# Altium project UAARG Autopilot.PrjPcb (part 1 of 3)
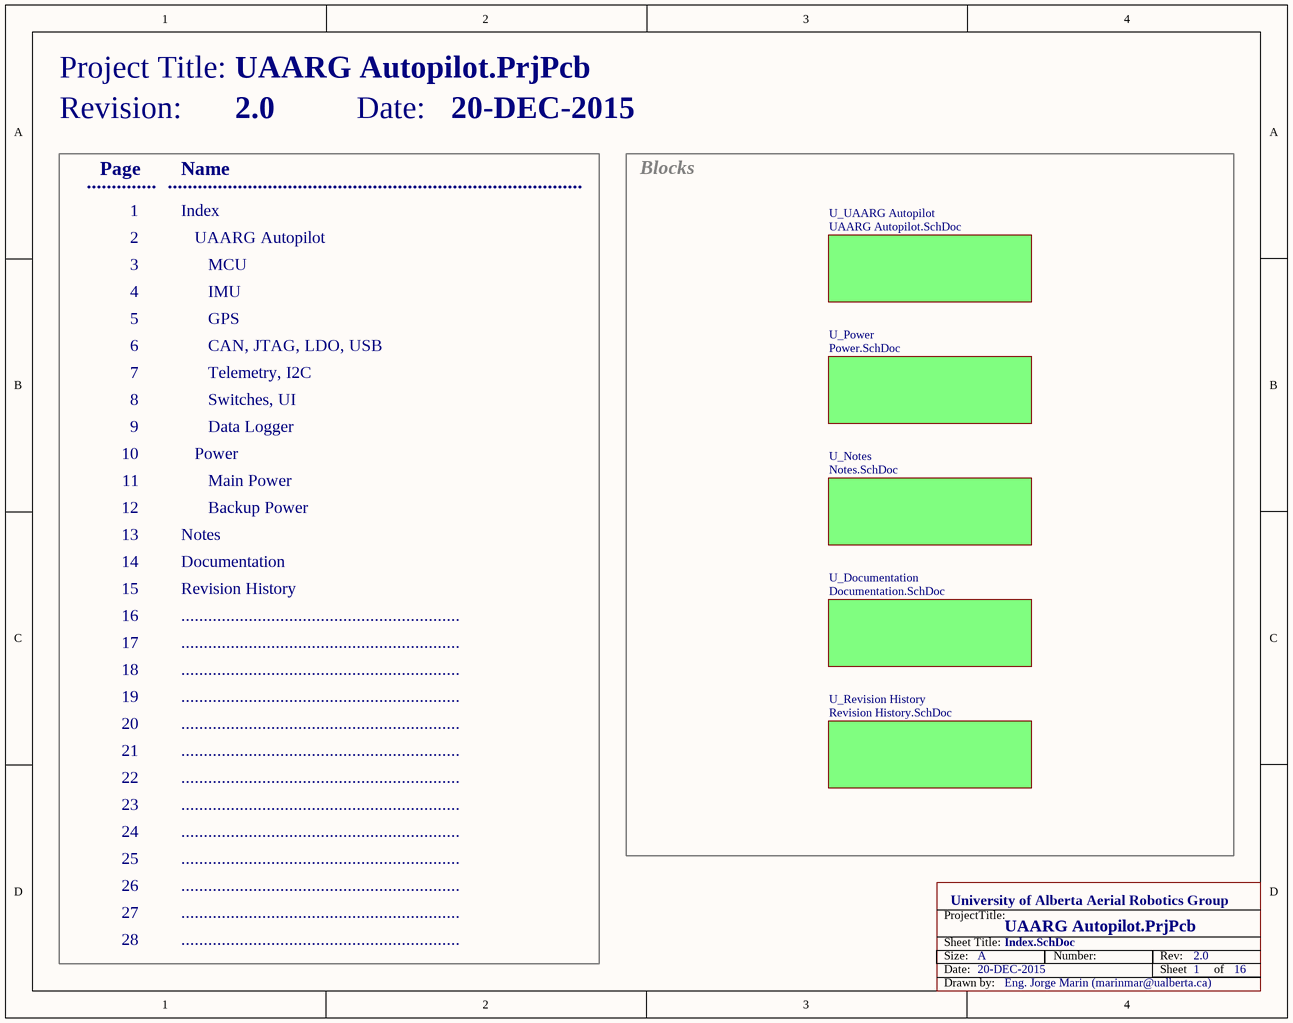
[diagram p0: Index.SchDoc]
Project_Author: Eng. Jorge Marin (marinmar@ualberta.ca); Project_Date: 20-DEC-2015; Project_Organization: University of Alberta Aerial Robotics Group; Project_Revision: 2.0
16 sheets, 296 parts. Net scope: hierarchical (ports join the sheet entries above them; power ports are global).
Board file: UAARG Autopilot.PcbDoc
Sheets:
  Index.SchDoc
    U_Documentation = Documentation.SchDoc
    U_Revision History = Revision History.SchDoc
    U_UAARG Autopilot = UAARG Autopilot.SchDoc
      U_Data Logger = Data Logger.SchDoc
      U_Switches, UI = Switches, UI.SchDoc
      U_MCU = MCU.SchDoc
      U_CAN, JTAG, LDO, USB = CAN, JTAG, LDO, USB.SchDoc
      U_Telemetry, I2C = Telemetry, I2C.SchDoc
      U_IMU = IMU.SchDoc
      U_GPS = GPS.SchDoc
      U_Connectors = Connectors.SchDoc
    U_Notes = Notes.SchDoc
    U_Power = Power.SchDoc
      U_Main Power = Main Power.SchDoc
      U_Backup Power = Backup Power.SchDoc

## Sheet Index.SchDoc
size A; DocumentNumber: 1; SheetNumber: 1; SheetTotal: 16

### Sub-sheets
U_Documentation = Documentation.SchDoc: no entries
U_Notes = Notes.SchDoc: no entries
U_Power = Power.SchDoc: no entries
U_Revision History = Revision History.SchDoc: no entries
U_UAARG Autopilot = UAARG Autopilot.SchDoc: no entries

### Notes on the sheet
- Project Title:
- Revision:
- Date:
- Blocks
- ..............
- Page
- 1
- ...................................................................................
- Name
- Index
- 2
- 3
- 4
- UAARG Autopilot
- MCU
- IMU
- 5
- 6
- CAN, JTAG, LDO, USB
- GPS
- 7
- 8
- 9
- Data Logger
- Telemetry, I2C
- Switches, UI
- 11
- 10
- Power
- Main Power
- 14
- 13
- 12
- Notes
- Documentation
- Backup Power
- 16
- 15
- ..............................................................
- Revision History
- 18
- 17
- 19
- 21
- 20
- 23
- 22
- 24
- 25
- 26
- 27
- 28
- Sheet Title:
- ProjectTitle:
- Size:
- A
- Number:
- Rev:
- Sheet         of
- Drawn by:

## Sheet Documentation.SchDoc
size A; DocumentNumber: 15; SheetNumber: 15; SheetTotal: 16
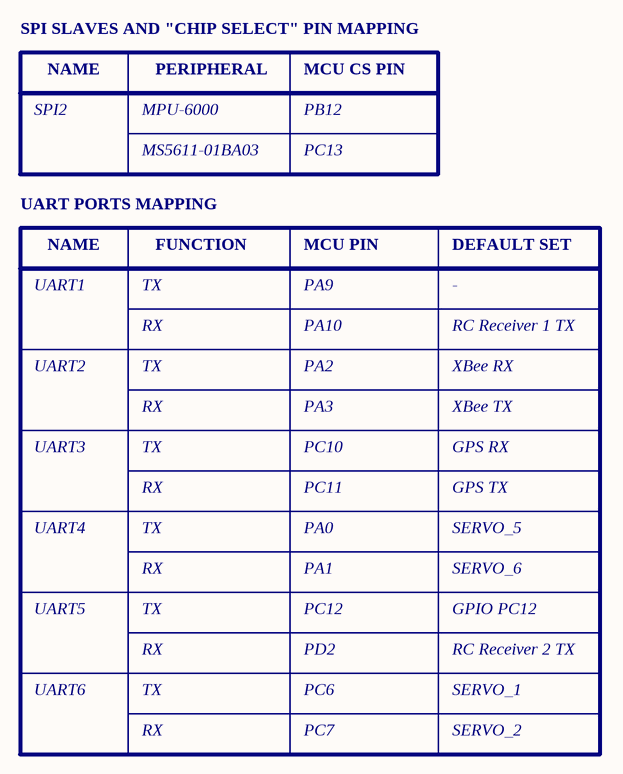
[diagram p1: Documentation.SchDoc]

### Notes on the sheet
- SPI SLAVES AND "CHIP SELECT" PIN MAPPING
- NAME
- PERIPHERAL
- MCU CS PIN
- SPI2
- MPU-6000
- MS5611-01BA03
- PB12
- PC13
- UART PORTS MAPPING
- UART1
- TX
- FUNCTION
- PA9
- MCU PIN
- -
- DEFAULT SET
- UART2
- RX
- PA10
- PA2
- RC Receiver 1 TX
- XBee RX
- PA3
- XBee TX
- UART3
- PC10
- PC11
- GPS RX
- GPS TX
- UART4
- PA0
- PA1
- SERVO_5
- SERVO_6
- UART5
- PC12
- GPIO PC12
- UART6
- PD2
- PC6
- RC Receiver 2 TX
- SERVO_1
- PC7
- SERVO_2
- Sheet Title:
- ProjectTitle:
- Size:
- Date:
- Company:
- A
- Number:
- Rev:
- Sheet         of
- Drawn by:

## Sheet Revision History.SchDoc
size A; Date: 06-March-2015; DrawnBy: Eng. Jorge Marin; DocumentNumber: 16; Revision: 1.0; SheetNumber: 16; SheetTotal: 16; ImagePath: C:\Users\Jorge\Desktop\Bynde Technologies\Logo.jpg; ProjectName: Bynde Device 1; Rule: PcbType=ProtelPcb
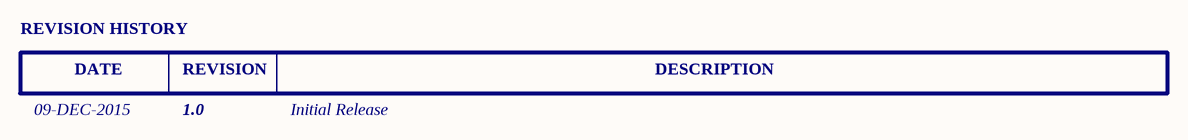
[diagram p2: Revision History.SchDoc]

### Notes on the sheet
- REVISION HISTORY
- 09-DEC-2015
- DATE
- 1.0
- REVISION
- Initial Release
- DESCRIPTION
- Sheet Title:
- ProjectTitle:
- Size:
- Date:
- Company:
- A
- Number:
- Rev:
- Sheet         of
- Drawn by:

## Sheet UAARG Autopilot.SchDoc
size 355 x 228 mm; DocumentNumber: 2; SheetNumber: 2; SheetTotal: 16
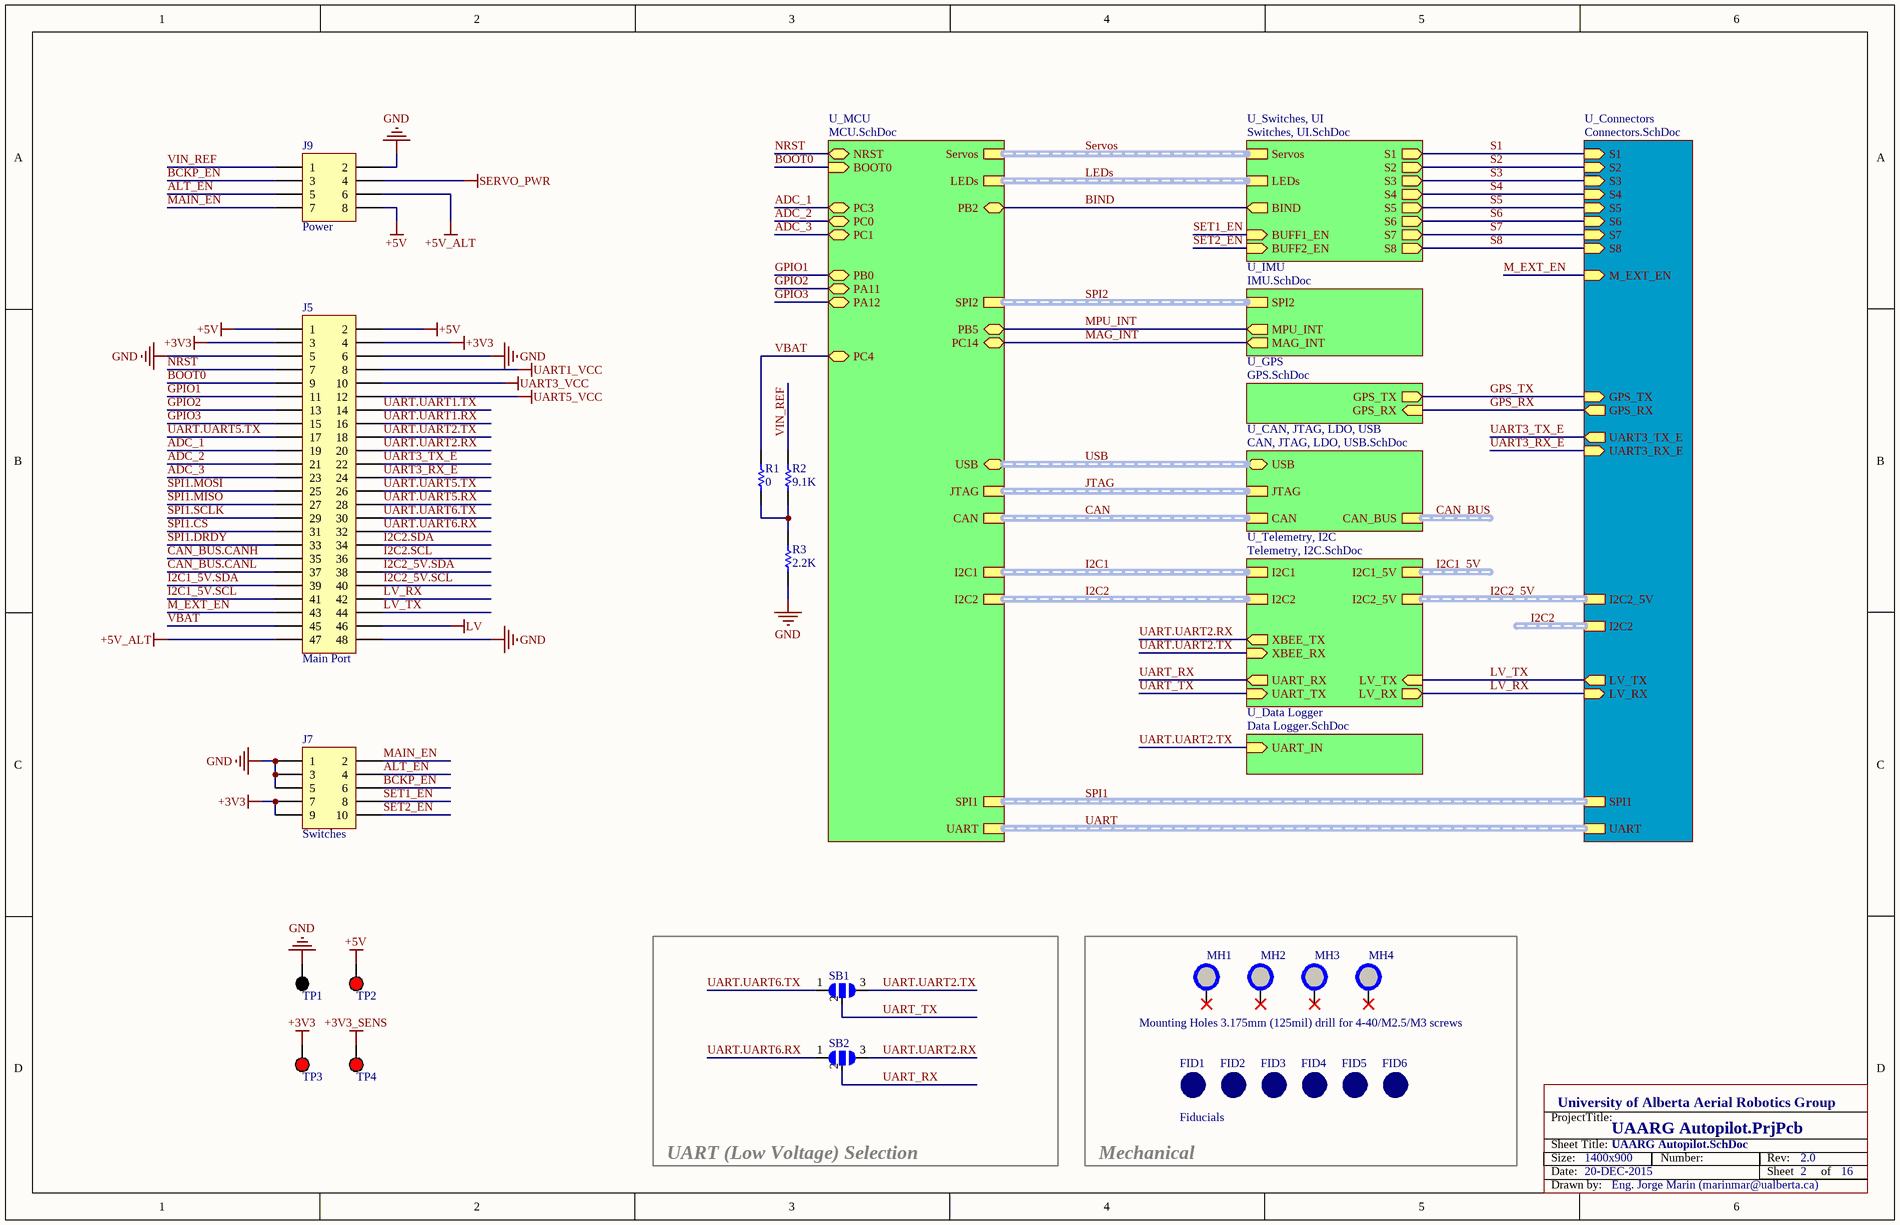
[diagram p3: UAARG Autopilot.SchDoc]

### Parts
FID1  Ficudial  [FIDUCIAL_1]  (value not drawn)  (no BOM)
FID2  Ficudial  [FIDUCIAL_1]  (value not drawn)  (no BOM)
FID3  Ficudial  [FIDUCIAL_1]  (value not drawn)  (no BOM)
FID4  Ficudial  [FIDUCIAL_1]  (value not drawn)  (no BOM)
FID5  Ficudial  [FIDUCIAL_1]  (value not drawn)  (no BOM)
FID6  Ficudial  [FIDUCIAL_1]  (value not drawn)  (no BOM)
J5  Main Port  [HDR_2X24]  (no BOM)
J7  Switches  [HDR_2X05]  (no BOM)
J9  Power  [2X04]  (no BOM)
MH1  Mounting Hole  [MOUNTINGHOLE_6]  (value not drawn)  (no BOM)
MH2  Mounting Hole  [MOUNTINGHOLE_6]  (value not drawn)  (no BOM)
MH3  Mounting Hole  [MOUNTINGHOLE_6]  (value not drawn)  (no BOM)
MH4  Mounting Hole  [MOUNTINGHOLE_6]  (value not drawn)  (no BOM)
R1  value 0  [RES_0402[1005M]]  (hidden comment: RES)
R2  value 9.1K  [RES_0603[1608M]]  (hidden comment: RES)
R3  value 2.2K  [RES_0603[1608M]]  (hidden comment: RES)
SB1  SMD Jumper 1  [SMD JUMPER 1]  (value not drawn)  (no BOM)
SB2  SMD Jumper 1  [SMD JUMPER 1]  (value not drawn)  (no BOM)
TP1  Test Point GND  [TP_TH_1_SILK]  (value not drawn)  (no BOM)
TP2  Test Point VCC  [TP_TH_1_SILK]  (value not drawn)  (no BOM)
TP3  Test Point VCC  [TP_TH_1_SILK]  (value not drawn)  (no BOM)
TP4  Test Point VCC  [TP_TH_1_SILK]  (value not drawn)  (no BOM)

### Blocks framed on the sheet
UART (Low Voltage) Selection: SB1 SB2
Mechanical: FID1-FID6 MH1-MH4

### Sub-sheets
U_CAN, JTAG, LDO, USB = CAN, JTAG, LDO, USB.SchDoc: JTAG (harness JTAG), CAN (harness CAN), CAN_BUS (harness CAN_BUS), USB (harness USB)
U_Connectors = Connectors.SchDoc: S1 (in), S2 (in), S3 (in), S4 (in), S5 (in), S6 (in), S7 (in), S8 (in), M_EXT_EN (in), I2C2 (harness I2C2), I2C2_5V (harness I2C2_5V), UART (harness UART), GPS_TX (in), GPS_RX (out), SPI1 (harness SPI1), LV_TX (out), LV_RX (in), UART3_RX_E (in), UART3_TX_E (out)
U_Data Logger = Data Logger.SchDoc: UART_IN (in)
U_GPS = GPS.SchDoc: GPS_RX (in), GPS_TX (out)
U_IMU = IMU.SchDoc: MPU_INT (out), MAG_INT (out), SPI2 (harness SPI2)
U_MCU = MCU.SchDoc: PB0 (bidir), PB2 (bidir), PB5 (bidir), PA11 (bidir), PA12 (bidir), PC0 (bidir), PC1 (bidir), PC3 (bidir), PC4 (bidir), PC14 (bidir), NRST (bidir), BOOT0 (in), Servos (harness Servos), JTAG (harness JTAG), CAN (harness CAN), I2C1 (harness I2C1), I2C2 (harness I2C2), LEDs (harness LEDs), SPI1 (harness SPI1), SPI2 (harness SPI2), UART (harness UART), USB (harness USB)
U_Switches, UI = Switches, UI.SchDoc: S1 (out), S2 (out), S3 (out), S4 (out), S5 (out), S6 (out), S7 (out), S8 (out), LEDs (harness LEDs), Servos (harness Servos), BIND (out), BUFF1_EN (in), BUFF2_EN (in)
U_Telemetry, I2C = Telemetry, I2C.SchDoc: XBEE_RX (in), XBEE_TX (out), LV_RX (out), LV_TX (in), I2C1 (harness I2C1), I2C2 (harness I2C2), I2C1_5V (harness I2C1_5V), I2C2_5V (harness I2C2_5V), UART_TX (in), UART_RX (out)

### Nets
+3V3: J5.3 J5.4 J7.7 J7.9 TP3.1
+3V3_SENS: TP4.1
+5V: J5.1 J5.2 J9.8 TP2.1
+5V_ALT: J5.47 J9.6
GND: J5.5 J5.6 J5.48 J7.1 J7.3 J7.5 J9.2 R3.1 TP1.1
LV: J5.46
SERVO_PWR: J9.4
UART1_VCC: J5.8
UART3_VCC: J5.10
UART5_VCC: J5.12
ADC_1: J5.19 ; sheet U_MCU/PC3
ADC_2: J5.21 ; sheet U_MCU/PC0
ADC_3: J5.23 ; sheet U_MCU/PC1
ALT_EN: J7.4 J9.5
BCKP_EN: J7.6 J9.3
BIND: sheet U_Switches, UI/BIND, sheet U_MCU/PB2
BOOT0: J5.9 ; sheet U_MCU/BOOT0
CAN_BUS.CANH: J5.35
CAN_BUS.CANL: J5.37
GPIO1: J5.11 ; sheet U_MCU/PB0
GPIO2: J5.13 ; sheet U_MCU/PA11  [project net D_N]
GPIO3: J5.15 ; sheet U_MCU/PA12  [project net D_P]
GPS_RX: sheet U_GPS/GPS_RX, sheet U_Connectors/GPS_RX
GPS_TX: sheet U_GPS/GPS_TX, sheet U_Connectors/GPS_TX
I2C1_5V.SCL: J5.41
I2C1_5V.SDA: J5.39
I2C2.SCL: J5.36
I2C2.SDA: J5.34
I2C2_5V.SCL: J5.40
I2C2_5V.SDA: J5.38
LV_RX: J5.42 ; sheet U_Telemetry, I2C/LV_RX, sheet U_Connectors/LV_RX
LV_TX: J5.44 ; sheet U_Telemetry, I2C/LV_TX, sheet U_Connectors/LV_TX
M_EXT_EN: J5.43 ; sheet U_Connectors/M_EXT_EN
MAG_INT: sheet U_MCU/PC14, sheet U_IMU/MAG_INT
MAIN_EN: J7.2 J9.7
MPU_INT: sheet U_MCU/PB5, sheet U_IMU/MPU_INT
NRST: J5.7 ; sheet U_MCU/NRST  [project net JTAG.RST]
S1: sheet U_Switches, UI/S1, sheet U_Connectors/S1
S2: sheet U_Switches, UI/S2, sheet U_Connectors/S2
S3: sheet U_Switches, UI/S3, sheet U_Connectors/S3
S4: sheet U_Switches, UI/S4, sheet U_Connectors/S4
S5: sheet U_Switches, UI/S5, sheet U_Connectors/S5
S6: sheet U_Switches, UI/S6, sheet U_Connectors/S6
S7: sheet U_Switches, UI/S7, sheet U_Connectors/S7
S8: sheet U_Switches, UI/S8, sheet U_Connectors/S8
SET1_EN: J7.8 ; sheet U_Switches, UI/BUFF1_EN
SET2_EN: J7.10 ; sheet U_Switches, UI/BUFF2_EN
SPI1.CS: J5.31
SPI1.DRDY: J5.33
SPI1.MISO: J5.27
SPI1.MOSI: J5.25
SPI1.SCLK: J5.29
UART3_RX_E: J5.24 ; sheet U_Connectors/UART3_RX_E
UART3_TX_E: J5.22 ; sheet U_Connectors/UART3_TX_E
UART.UART1.RX: J5.16
UART.UART1.TX: J5.14
UART.UART2.RX: J5.20 SB2.3 ; sheet U_Telemetry, I2C/XBEE_TX
UART.UART2.TX: J5.18 SB1.3 ; sheet U_Data Logger/UART_IN, sheet U_Telemetry, I2C/XBEE_RX
UART.UART5.RX: J5.28
UART.UART5.TX: J5.17 J5.26
UART.UART6.RX: J5.32 SB2.1
UART.UART6.TX: J5.30 SB1.1
UART_RX: SB2.2 ; sheet U_Telemetry, I2C/UART_RX
UART_TX: SB1.2 ; sheet U_Telemetry, I2C/UART_TX
VBAT: J5.45 R1.2 ; sheet U_MCU/PC4  [project net PC4]
VIN_REF: J9.1 R2.2
NetR1_1: R1.1 R2.1 R3.2

Not connected (* = marked no-connect by the designer): MH1 1*; MH2 1*; MH3 1*; MH4 1*

### Buses and harness runs
harness CAN = sheet U_CAN, JTAG, LDO, USB/CAN = sheet U_MCU/CAN
harness CAN_BUS = sheet U_CAN, JTAG, LDO, USB/CAN_BUS
harness I2C1 = sheet U_MCU/I2C1 = sheet U_Telemetry, I2C/I2C1
harness I2C1_5V = sheet U_Telemetry, I2C/I2C1_5V
harness I2C2 = sheet U_Connectors/I2C2
harness I2C2 = sheet U_MCU/I2C2 = sheet U_Telemetry, I2C/I2C2
harness I2C2_5V = sheet U_Connectors/I2C2_5V = sheet U_Telemetry, I2C/I2C2_5V
harness JTAG = sheet U_CAN, JTAG, LDO, USB/JTAG = sheet U_MCU/JTAG
harness LEDs = sheet U_MCU/LEDs = sheet U_Switches, UI/LEDs
harness Servos = sheet U_MCU/Servos = sheet U_Switches, UI/Servos
harness SPI1 = sheet U_Connectors/SPI1 = sheet U_MCU/SPI1
harness SPI2 = sheet U_IMU/SPI2 = sheet U_MCU/SPI2
harness UART = sheet U_Connectors/UART = sheet U_MCU/UART
harness USB = sheet U_CAN, JTAG, LDO, USB/USB = sheet U_MCU/USB

### Notes on the sheet
- Mounting Holes 3.175mm (125mil) drill for 4-40/M2.5/M3 screws
- Fiducials
- Sheet Title:
- ProjectTitle:
- Size:
- Date:
- 1400x900
- Number:
- Rev:
- Sheet         of
- Drawn by:

### Library data of the parts
FID1-FID6 = Ficudial: Fiducial
J5 = Header 24X2: Header, 24-Pin, Dual row
J7 = Header 5X2: Header, 5-Pin, Dual row
J9 = Header 4X2: Header, 4-Pin, Dual row
MH1-MH4 = Mounting Hole: pin to pad: 1>MH
R1 = RES: Resistor; Manufacturer Part Number: RC0402JR-070RL; Manufacturer: Yageo; Supplier 1: Digi-Key; Supplier Part Number 1: 311-0.0JRCT-ND; ComponentLink1URL: http://www.yageo.com/NewPortal/yageodocoutput?fileName=/pdf/R-Chip/PYu-RC_Group_51_RoHS_L_3.pdf; ComponentLink1Description: Datasheet
R2 = RES: Resistor; Manufacturer Part Number: RC0603FR-079K1L; Manufacturer: Yageo; Supplier 1: Digi-Key; Supplier Part Number 1: 311-9.10KHRCT-ND; ComponentLink1URL: http://www.yageo.com/NewPortal/yageodocoutput?fileName=/pdf/R-Chip/PYu-RC_Group_51_RoHS_L_3.pdf; ComponentLink1Description: Datasheet
R3 = RES: Resistor; Manufacturer: Yageo; Manufacturer Part Number: RC0603FR-072K2L; Supplier 1: Digi-Key; Supplier Part Number 1: 311-2.20KHRCT-ND; ComponentLink1URL: http://www.yageo.com/NewPortal/yageodocoutput?fileName=/pdf/R-Chip/PYu-RC_Group_51_RoHS_L_3.pdf; ComponentLink1Description: Datasheet
SB1 SB2 = SMD Jumper 1: SMD Jumper 3 positions. Open
TP1 = Test Point GND: Test Point Ground
TP2-TP4 = Test Point VCC: Test Point Power

## Sheet Data Logger.SchDoc
size A; DocumentNumber: 10; SheetNumber: 10; SheetTotal: 16
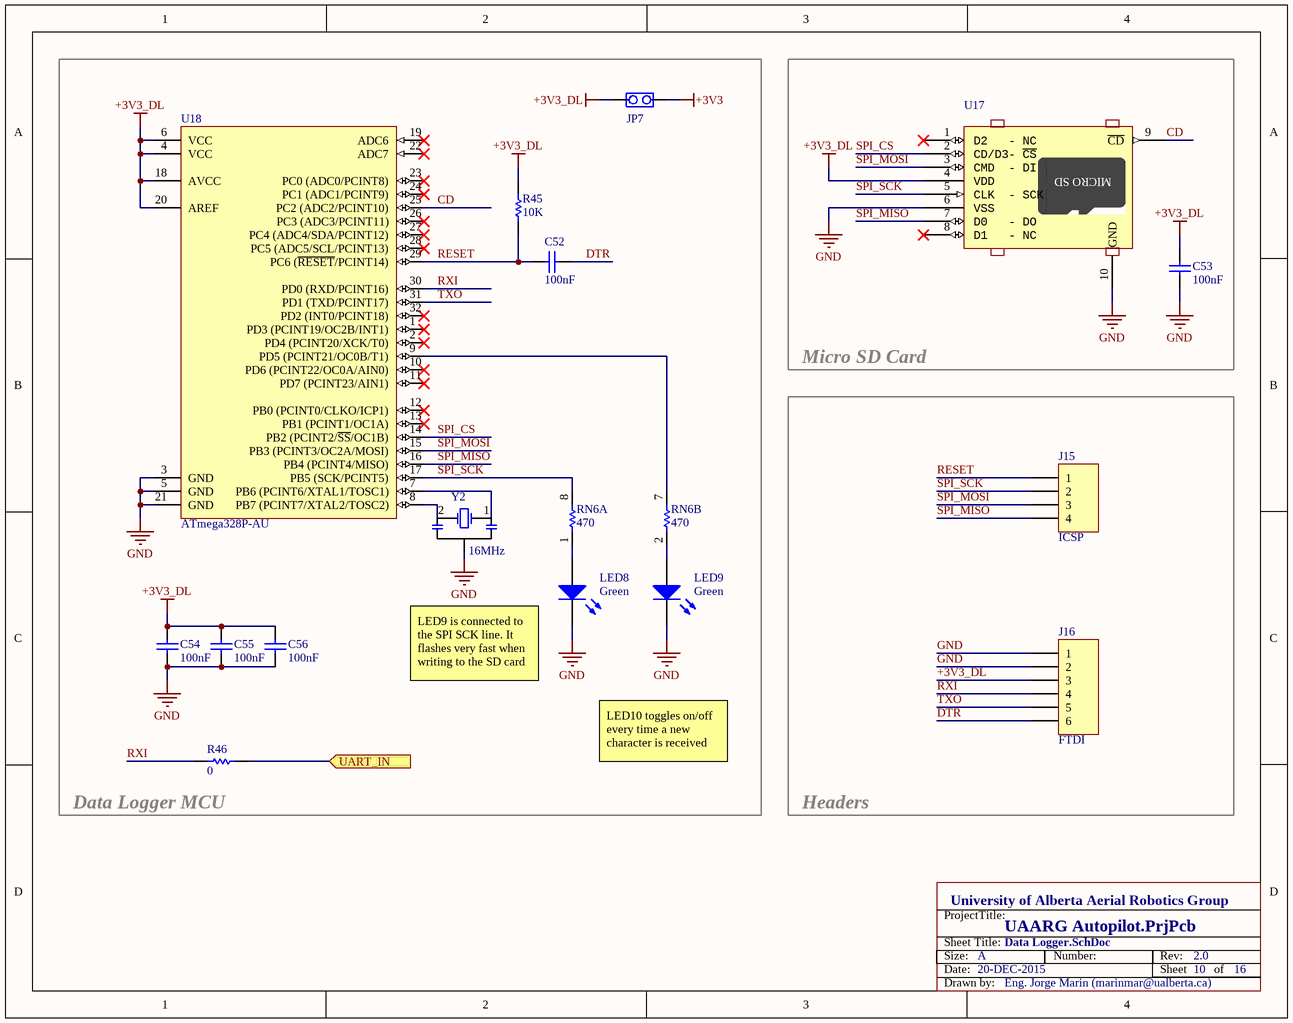
[diagram p4: Data Logger.SchDoc]

### Parts
C52  value 100nF  [CAP_0402[1005M]]  (hidden comment: Cap)
C53  value 100nF  [CAP_0402[1005M]]  (hidden comment: Cap)
C54  value 100nF  [CAP_0402[1005M]]  (hidden comment: Cap)
C55  value 100nF  [CAP_0402[1005M]]  (hidden comment: Cap)
C56  value 100nF  [CAP_0402[1005M]]  (hidden comment: Cap)
J15  ICSP  [1X04]  (no BOM)
J16  FTDI  [HEADER RA 6 2.54]
JP7  Jumper  [HDR_1x02_JMP]  (value not drawn)  (no BOM)
LED8  Color: Green  [LED_0603[1608M]]  (hidden comment: LED)
LED9  Color: Green  [LED_0603[1608M]]  (hidden comment: LED)
R45  value 10K  [RES_0402[1005M]]  (hidden comment: RES)
R46  value 0  [JUMPER_RES_0402]  (hidden comment: RES)
RN6  value 470  [RES ARRAY SMD]  (hidden comment: Res Network 1)  (parts A,B of 4)
U17  MICRO-SD_1  [MICRO-SD_1]  (value not drawn)
U18  ATmega328P-AU  [TQFP32A_M]
Y2  Frequency: 16MHz  [RESONATOR_3213]  (hidden comment: XTAL_3)

### Blocks framed on the sheet
Data Logger MCU: C52 C54-C56 JP7 LED8 LED9 R45 R46 RN6 U18 Y2
Micro SD Card: C53 U17
Headers: J15 J16

### Ports
UART_IN (in)

### Nets
+3V3: JP7.2
+3V3_DL: C53.1 C54.1 C55.1 C56.1 J16.3 JP7.1 R45.2 U17.4(VDD) U18.4(VCC) U18.6(VCC) U18.18(AVCC) U18.20(AREF)
GND: C53.2 C54.2 C55.2 C56.2 J16.1 J16.2 LED8.2(K) LED9.2(K) U17.6(VSS) U17.10(GND) U18.3(GND) U18.5(GND) U18.21(GND) Y2.3(GND)
CD: U17.9(~{CD}) U18.25(PC2_(ADC2/PCINT10))
DTR: C52.2 J16.6
RESET: C52.1 J15.1 R45.1 U18.29(PC6_(~{RESET}/PCINT14))
RXI: J16.4 R46.2 U18.30(PD0_(RXD/PCINT16))
SPI_CS: U17.2(CD/D3-_~{CS}) U18.14(PB2_(PCINT2/~{SS}/OC1B))
SPI_MISO: J15.4 U17.7(D0___-_DO) U18.16(PB4_(PCINT4/MISO))
SPI_MOSI: J15.3 U17.3(CMD__-_DI) U18.15(PB3_(PCINT3/OC2A/MOSI))
SPI_SCK: J15.2 RN6.8 U17.5(CLK__-_SCK) U18.17(PB5_(SCK/PCINT5))
TXO: J16.5 U18.31(PD1_(TXD/PCINT17))
UART.UART2.TX: R46.1 ; port UART_IN
NetLED8_1: LED8.1(A) RN6.1
NetLED9_1: LED9.1(A) RN6.2
NetRN6_7: RN6.7 U18.9(PD5_(PCINT21/OC0B/T1))
NetU18_7: U18.7(PB6_(PCINT6/XTAL1/TOSC1)) Y2.1(OSC1)
NetU18_8: U18.8(PB7_(PCINT7/XTAL2/TOSC2)) Y2.2(OSC2)

Not connected (* = marked no-connect by the designer): U17 1(D2___-_NC)* 8(D1___-_NC)*; U18 1(PD3_(PCINT19/OC2B/INT1))* 2(PD4_(PCINT20/XCK/T0))* 10(PD6_(PCINT22/OC0A/AIN0))* 11(PD7_(PCINT23/AIN1))* 12(PB0_(PCINT0/CLKO/ICP1))* 13(PB1_(PCINT1/OC1A))* 19(ADC6)* 22(ADC7)* 23(PC0_(ADC0/PCINT8))* 24(PC1_(ADC1/PCINT9))* 26(PC3_(ADC3/PCINT11))* 27(PC4_(ADC4/SDA/PCINT12))* 28(PC5_(ADC5/SCL/PCINT13))* 32(PD2_(INT0/PCINT18))*

### Notes on the sheet
- (near LED8) LED9 is connected to the SPI SCK line. It flashes very fast when writing to the SD card
- LED10 toggles on/off every time a new character is received
- Sheet Title:
- ProjectTitle:
- Size:
- Date:
- A
- Number:
- Rev:
- Sheet         of
- Drawn by:
- (in symbol MICRO-SD_1) MICRO SD

### Library data of the parts
C52-C56 = Cap: CAP CER 0.1UF 10V 10% X7R 0402; Manufacturer: Yageo; Manufacturer Part Number: CC0402KRX7R6BB104; Supplier 1: Digi-Key; Supplier Part Number 1: 311-1345-1-ND; ComponentLink1Description: Datasheet; ComponentLink1URL: http://www.yageo.com/documents/recent/UPY-GPHC_X7R_6.3V-to-50V-v12.pdf
J15 = Header 4: Header, 4-Pin
J16 = Header 6: Header, 6-Pin; Manufacturer Part Number: 961106-5500-AR-PR; Manufacturer: 3M; Supplier 1: Digi-Key; Supplier Part Number 1: 3M9501CT-ND; ComponentLink1URL: http://multimedia.3m.com/mws/mediawebserver?66666UuZjcFSLXTtNxTEmxfXEVuQEcuZgVs6EVs6E666666--; ComponentLink1Description: Datasheet
LED8 LED9 = LED: LED GREEN CLEAR 0603 SMD; Manufacturer: Lite-On Inc.; Manufacturer Part Number: LTST-C190KGKT; Supplier 1: Digi-Key; Supplier Part Number 1: 160-1435-1-ND; ComponentLink1URL: http://optoelectronics.liteon.com/upload/download/DS22-2000-074/S_110_LTST-C190KGKT.pdf; ComponentLink1Description: Datasheet
R45 = RES: Resistor; Manufacturer: Yageo; Manufacturer Part Number: RC0402FR-0710KL; Supplier 1: Digi-Key; Supplier Part Number 1: 311-10.0KLRCT-ND; ComponentLink1URL: http://www.yageo.com/NewPortal/yageodocoutput?fileName=/pdf/R-Chip/PYu-RC_Group_51_RoHS_L_3.pdf; ComponentLink1Description: Datasheet
R46 = RES: as R1 on sheet UAARG Autopilot; Supplier 1: Digi-Key; Supplier Part Number 1: 311-0.0JRCT-ND; ComponentLink1URL: http://www.yageo.com/NewPortal/yageodocoutput?fileName=/pdf/R-Chip/PYu-RC_Group_51_RoHS_L_3.pdf; ComponentLink1Description: Datasheet
RN6 = Res Network 1: Isolated Resistor Network; Manufacturer: Yageo; Manufacturer Part Number: YC164-JR-07470RL; Supplier 1: Digi-Key; Supplier Part Number 1: YC164J-470CT-ND; ComponentLink1URL: http://www.yageo.com/NewPortal/yageodocoutput?fileName=/pdf/R-Chip/PYu-YC_TC_group_51_RoHS_L_0.pdf; ComponentLink1Description: Datasheet
U17 = MICRO-SD_1: GCT MEM2051-00-195-00-A; Manufacturer: GLOBAL CONNECTOR TECHNOLOGY; Supplier 1: Newark; Supplier Part Number 1: 05W3557; ComponentLink1URL: http://www.farnell.com/datasheets/1792863.pdf; ComponentLink1Description: Datasheet; Manufacturer Part Number: MEM2051-00-195-00-A
U18 = ATmega328P-AU: 8-bit AVR Microcontroller, 32KB Flash, 1KB EEPROM, 2KB SRAM, 32-pin TQFP, Industrial Grade (-40°C to 85°C); Manufacturer: Atmel; PackageVersion: revB, Oct-2001; Supplier 1: Digi-Key; Supplier Part Number 1: ATMEGA328P-AU-ND; Code_JEDEC: MS-026-ABA; ComponentLink1Description: Datasheet; ComponentLink1URL: http://www.atmel.com/dyn/resources/prod_documents/8271.pdf; ComponentLink2Description: ATmega48A/48PA/88A/88PA/168A/168PA/328/328P Summary; ComponentLink2URL: http://www.atmel.com/dyn/resources/prod_documents/8271S.pdf; ComponentLink3Description: Atmel.com Home; ComponentLink3URL: http://www.atmel.com; Manufacturer Part Number: ATMEGA328P-AU
Y2 = XTAL_3: Resonator with built in capacitors; Manufacturer Part Number: CSTCE16M0V53-R0; Manufacturer: Murata Electronics North America; Capacitance: 15pF; Supplier 1: Digi-Key; Supplier Part Number 1: 490-1198-1-ND; ComponentLink1URL: http://www.murata.com/~/media/webrenewal/support/library/catalog/products/timingdevice/ceralock/p16e.ashx; ComponentLink1Description: Datasheet

## Sheet Switches, UI.SchDoc
size A; DocumentNumber: 9; SheetNumber: 9; SheetTotal: 16
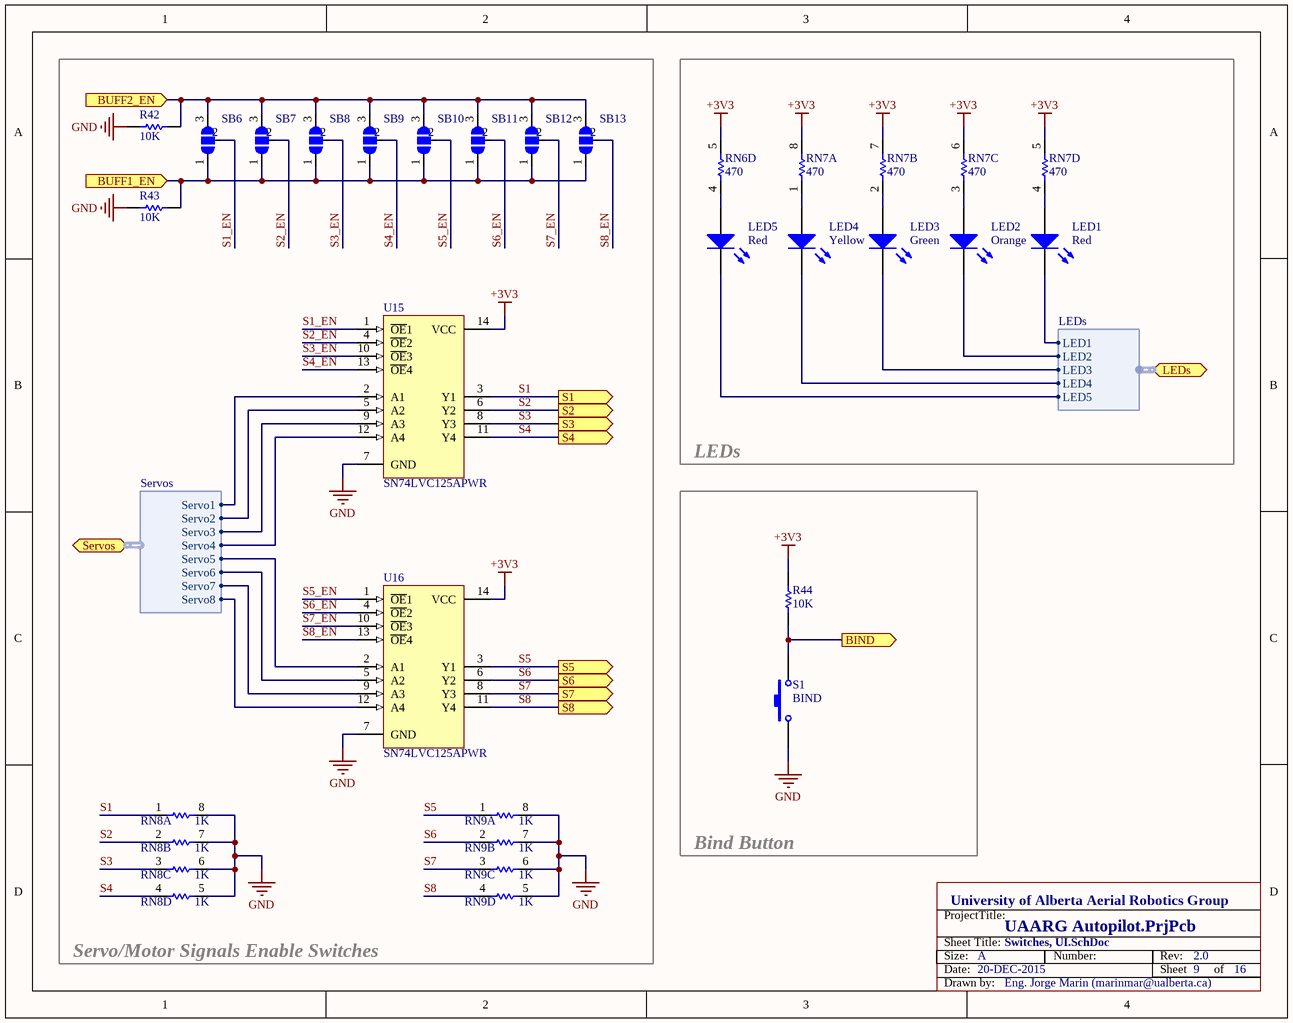
[diagram p5: Switches, UI.SchDoc]

### Parts
LED1  Color: Red  [LED_0603[1608M]]  (hidden comment: LED)
LED2  Color: Orange  [LED_0603[1608M]]  (hidden comment: LED)
LED3  Color: Green  [LED_0603[1608M]]  (hidden comment: LED)
LED4  Color: Yellow  [LED_0603[1608M]]  (hidden comment: LED)
LED5  Color: Red  [LED_0603[1608M]]  (hidden comment: LED)
R42  value 10K  [RES_0402[1005M]]  (hidden comment: RES)
R43  value 10K  [RES_0402[1005M]]  (hidden comment: RES)
R44  value 10K  [RES_0402[1005M]]  (hidden comment: RES)
RN6  value 470  [RES ARRAY SMD]  (hidden comment: Res Network 1)  (part D of 4)
RN7  value 470  [RES ARRAY SMD]  (hidden comment: Res Network 1)  (parts A,B,C,D of 4)
RN8  value 1K  [RES ARRAY SMD]  (hidden comment: Res Network 1)  (parts A,B,C,D of 4)
RN9  value 1K  [RES ARRAY SMD]  (hidden comment: Res Network 1)  (parts A,B,C,D of 4)
S1  BIND  [SMD TACTILE SW KMR 2]
SB6  SMD Jumper 1  [SMD JUMPER 1]  (value not drawn)  (no BOM)
SB7  SMD Jumper 1  [SMD JUMPER 1]  (value not drawn)  (no BOM)
SB8  SMD Jumper 1  [SMD JUMPER 1]  (value not drawn)  (no BOM)
SB9  SMD Jumper 1  [SMD JUMPER 1]  (value not drawn)  (no BOM)
SB10  SMD Jumper 1  [SMD JUMPER 1]  (value not drawn)  (no BOM)
SB11  SMD Jumper 1  [SMD JUMPER 1]  (value not drawn)  (no BOM)
SB12  SMD Jumper 1  [SMD JUMPER 1]  (value not drawn)  (no BOM)
SB13  SMD Jumper 1  [SMD JUMPER 1]  (value not drawn)  (no BOM)
U15  SN74LVC125APWR  [TSSOP-14]
U16  SN74LVC125APWR  [TSSOP-14]

### Blocks framed on the sheet
Servo/Motor Signals Enable Switches: R42 R43 RN8 RN9 SB6-SB13 U15 U16
LEDs: LED1-LED5 RN6 RN7
Bind Button: R44 S1

### Ports
BIND (out), BUFF1_EN (in), BUFF2_EN (in), LEDs (harness LEDs), S1 (out), S2 (out), S3 (out), S4 (out), S5 (out), S6 (out), S7 (out), S8 (out), Servos (harness Servos)

### Harnesses
LEDs: LED1, LED2, LED3, LED4, LED5
Servos: Servo1, Servo2, Servo3, Servo4, Servo5, Servo6, Servo7, Servo8

### Nets
+3V3: R44.2 RN6.5 RN7.5 RN7.6 RN7.7 RN7.8 U15.14(VCC) U16.14(VCC)
GND: R42.2 R43.2 RN8.5 RN8.6 RN8.7 RN8.8 RN9.5 RN9.6 RN9.7 RN9.8 S1.1 U15.7(GND) U16.7(GND)
BIND: R44.1 S1.2 ; port BIND
I2C1.SCL: U16.9(A3) ; port Servos.Servo7
I2C1.SDA: U16.12(A4) ; port Servos.Servo8
LEDs.LED1: LED1.2(K) ; port LEDs.LED1
LEDs.LED2: LED2.2(K) ; port LEDs.LED2
LEDs.LED3: LED3.2(K) ; port LEDs.LED3
LEDs.LED4: LED4.2(K) ; port LEDs.LED4
LEDs.LED5: LED5.2(K) ; port LEDs.LED5
PA0: U16.2(A1) ; port Servos.Servo5
PA1: U16.5(A2) ; port Servos.Servo6
PC6: U15.2(A1) ; port Servos.Servo1
PC7: U15.5(A2) ; port Servos.Servo2
PC8: U15.9(A3) ; port Servos.Servo3
PC9: U15.12(A4) ; port Servos.Servo4
S1: RN8.1 U15.3(Y1) ; port S1
S1_EN: SB6.2 U15.1(~{OE}1)
S2: RN8.2 U15.6(Y2) ; port S2
S2_EN: SB7.2 U15.4(~{OE}2)
S3: RN8.3 U15.8(Y3) ; port S3
S3_EN: SB8.2 U15.10(~{OE}3)
S4: RN8.4 U15.11(Y4) ; port S4
S4_EN: SB9.2 U15.13(~{OE}4)
S5: RN9.1 U16.3(Y1) ; port S5
S5_EN: SB10.2 U16.1(~{OE}1)
S6: RN9.2 U16.6(Y2) ; port S6
S6_EN: SB11.2 U16.4(~{OE}2)
S7: RN9.3 U16.8(Y3) ; port S7
S7_EN: SB12.2 U16.10(~{OE}3)
S8: RN9.4 U16.11(Y4) ; port S8
S8_EN: SB13.2 U16.13(~{OE}4)
SET1_EN: R43.1 SB6.1 SB7.1 SB8.1 SB9.1 SB10.1 SB11.1 SB12.1 SB13.1 ; port BUFF1_EN
SET2_EN: R42.1 SB6.3 SB7.3 SB8.3 SB9.3 SB10.3 SB11.3 SB12.3 SB13.3 ; port BUFF2_EN
NetLED1_1: LED1.1(A) RN7.4
NetLED2_1: LED2.1(A) RN7.3
NetLED3_1: LED3.1(A) RN7.2
NetLED4_1: LED4.1(A) RN7.1
NetLED5_1: LED5.1(A) RN6.4

### Notes on the sheet
- Sheet Title:
- ProjectTitle:
- Size:
- Date:
- A
- Number:
- Rev:
- Sheet         of
- Drawn by:

### Library data of the parts
LED1 LED5 = LED: LED RED CLEAR 0603 SMD; Manufacturer: Lite-On Inc.; Manufacturer Part Number: LTST-C190KRKT; Supplier 1: Digi-Key; Supplier Part Number 1: 160-1436-1-ND; ComponentLink1URL: http://optoelectronics.liteon.com/upload/download/DS-22-99-0151/S_110_LTST-C190KRKT.pdf; ComponentLink1Description: Datasheet
LED2 = LED: LED ORANGE CLEAR 0603 SMD; Manufacturer: Lite-On Inc.; Manufacturer Part Number: LTST-C190AKT; Supplier 1: Digi-Key; Supplier Part Number 1: 160-1180-1-ND; ComponentLink1URL: http://media.digikey.com/pdf/Data%20Sheets/Lite-On%20PDFs/LTST-C190AKT.pdf; ComponentLink1Description: Datasheet
LED3 = LED: as LED8 on sheet Data Logger; Supplier 1: Digi-Key; Supplier Part Number 1: 160-1435-1-ND; ComponentLink1URL: http://optoelectronics.liteon.com/upload/download/DS22-2000-074/S_110_LTST-C190KGKT.pdf; ComponentLink1Description: Datasheet
LED4 = LED: LED YELLOW CLEAR 0603 SMD; Manufacturer: Lite-On Inc.; Manufacturer Part Number: LTST-C190YKT; Supplier 1: Digi-Key; Supplier Part Number 1: 160-1184-1-ND; ComponentLink1URL: http://media.digikey.com/pdf/Data%20Sheets/Lite-On%20PDFs/LTST-C190YKT.pdf; ComponentLink1Description: Datasheet
R42-R44 = RES: as R45 on sheet Data Logger; Supplier 1: Digi-Key; Supplier Part Number 1: 311-10.0KLRCT-ND; ComponentLink1URL: http://www.yageo.com/NewPortal/yageodocoutput?fileName=/pdf/R-Chip/PYu-RC_Group_51_RoHS_L_3.pdf; ComponentLink1Description: Datasheet
RN6 RN7 = Res Network 1: as RN6 on sheet Data Logger; Supplier 1: Digi-Key; Supplier Part Number 1: YC164J-470CT-ND; ComponentLink1URL: http://www.yageo.com/NewPortal/yageodocoutput?fileName=/pdf/R-Chip/PYu-YC_TC_group_51_RoHS_L_0.pdf; ComponentLink1Description: Datasheet
RN8 RN9 = Res Network 1: Isolated Resistor Network; Manufacturer Part Number: YC164-JR-071KL; Manufacturer: Yageo; Supplier 1: Digi-Key; Supplier Part Number 1: YC164J-1.0KCT-ND; ComponentLink1URL: http://www.yageo.com/NewPortal/yageodocoutput?fileName=/pdf/R-Chip/PYu-YC_TC_group_51_RoHS_L_0.pdf; ComponentLink1Description: Datasheet
S1 = SW-PB: SWITCH TACTILE SPST-NO 0.05A 32V; pin to pad: 2>4; Manufacturer Part Number: KMR221GLFS; Manufacturer: C&K Components; Supplier 1: Digi-Key; Supplier Part Number 1: 401-1427-1-ND; ComponentLink1URL: http://www.mouser.com/ds/2/60/KMR2_9aug12-25127.pdf; ComponentLink1Description: Datasheet
SB6-SB13 = SMD Jumper 1: SMD Jumper 3 positions. Open
U15 U16 = DM74LS125AM: Manufacturer: Texas Instruments; Current - Output High, Low: 24mA, 24mA; Supplier 1: Digi-Key; Supplier Part Number 1: 296-1222-1-ND; ComponentLink1URL: http://www.ti.com/lit/ds/symlink/sn74lvc125a.pdf; ComponentLink1Description: Datasheet; Manufacturer Part Number: SN74LVC125APWR

## Sheet MCU.SchDoc
size A; DocumentNumber: 4; SheetNumber: 4; SheetTotal: 16
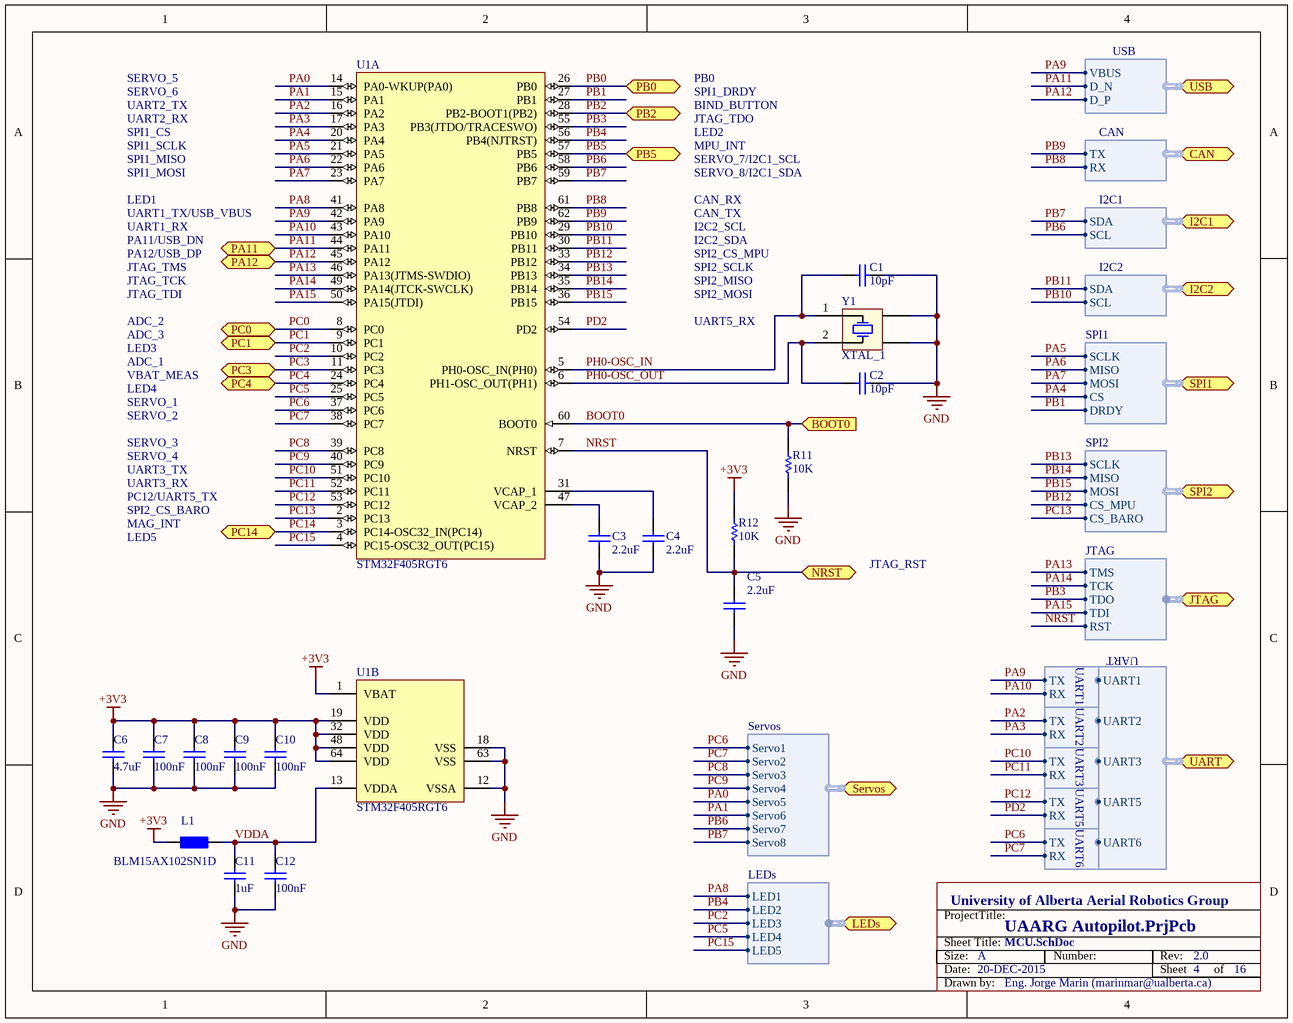
[diagram p6: MCU.SchDoc]

### Parts
C1  value 10pF  [CAP_0402[1005M]]  (hidden comment: CAP)
C2  value 10pF  [CAP_0402[1005M]]  (hidden comment: CAP)
C3  value 2.2uF  [CAP_0402[1005M]]  (hidden comment: CAP)
C4  value 2.2uF  [CAP_0402[1005M]]  (hidden comment: CAP)
C5  value 2.2uF  [CAP_0402[1005M]]  (hidden comment: CAP)
C6  value 4.7uF  [CAP_0603[1608M]]  (hidden comment: CAP)
C7  value 100nF  [CAP_0402[1005M]]  (hidden comment: Cap)
C8  value 100nF  [CAP_0402[1005M]]  (hidden comment: Cap)
C9  value 100nF  [CAP_0402[1005M]]  (hidden comment: Cap)
C10  value 100nF  [CAP_0402[1005M]]  (hidden comment: Cap)
C11  value 1uF  [CAP_0402[1005M]]  (hidden comment: CAP)
C12  value 100nF  [CAP_0402[1005M]]  (hidden comment: Cap)
L1  BLM15AX102SN1D  [GEN_0402[1005M]]
R11  value 10K  [RES_0402[1005M]]  (hidden comment: RES)
R12  value 10K  [RES_0402[1005M]]  (hidden comment: RES)
U1  STM32F405RGT6  [STM-LQFP64_N]  (parts A,B of 2)
Y1  XTAL_1  [CRYSTAL SMD3 ABM8G 3225]

### Ports
BOOT0 (in), CAN (harness CAN), I2C1 (harness I2C1), I2C2 (harness I2C2), JTAG (harness JTAG), LEDs (harness LEDs), NRST (bidir), PA11 (bidir), PA12 (bidir), PB0 (bidir), PB2 (bidir), PB5 (bidir), PC0 (bidir), PC1 (bidir), PC3 (bidir), PC4 (bidir), PC14 (bidir), Servos (harness Servos), SPI1 (harness SPI1), SPI2 (harness SPI2), UART (harness UART), USB (harness USB)

### Harnesses
Servos: Servo1, Servo2, Servo3, Servo4, Servo5, Servo6, Servo7, Servo8
JTAG: TMS, TCK, TDO, TDI, RST
CAN: TX, RX
I2C1: SDA, SCL
I2C2: SDA, SCL
LEDs: LED1, LED2, LED3, LED4, LED5
SPI1: SCLK, MOSI, MISO, CS, DRDY
SPI2: SCLK, MOSI, MISO, CS_MPU, CS_BARO
USB: VBUS, D_N, D_P
UART2: TX, RX
UART3: TX, RX
UART1: TX, RX
UART5: TX, RX
UART6: TX, RX
UART: UART1, UART2, UART3, UART5, UART6

### Nets
+3V3: C6.2 C7.1 C8.1 C9.1 C10.1 L1.1 R12.2 U1.1(VBAT) U1.19(VDD) U1.32(VDD) U1.48(VDD) U1.64(VDD)
GND: C1.1 C2.1 C3.1 C4.1 C5.1 C6.1 C7.2 C8.2 C9.2 C10.2 C11.1 C12.2 R11.1 U1.12(VSSA) U1.18(VSS) U1.63(VSS) Y1.3(GND) Y1.4(GND)
BOOT0: R11.2 U1.60(BOOT0) ; port BOOT0
NRST: C5.2 R12.1 U1.7(NRST) ; port NRST, port JTAG.RST  [project net JTAG.RST]
PA0: U1.14(PA0-WKUP(PA0)) ; port Servos.Servo5
PA1: U1.15(PA1) ; port Servos.Servo6
PA2: U1.16(PA2) ; harness UART2.TX
PA3: U1.17(PA3) ; harness UART2.RX
PA4: U1.20(PA4) ; port SPI1.CS
PA5: U1.21(PA5) ; port SPI1.SCLK
PA6: U1.22(PA6) ; port SPI1.MISO
PA7: U1.23(PA7) ; port SPI1.MOSI
PA8: U1.41(PA8) ; port LEDs.LED1  [project net LEDs.LED1]
PA9: U1.42(PA9) ; port USB.VBUS, harness UART1.TX
PA10: U1.43(PA10) ; harness UART1.RX
PA11: U1.44(PA11) ; port PA11, port USB.D_N  [project net D_N]
PA12: U1.45(PA12) ; port PA12, port USB.D_P  [project net D_P]
PA13: U1.46(PA13(JTMS-SWDIO)) ; port JTAG.TMS  [project net JTAG.TMS]
PA14: U1.49(PA14(JTCK-SWCLK)) ; port JTAG.TCK  [project net JTAG.TCK]
PA15: U1.50(PA15(JTDI)) ; port JTAG.TDI  [project net JTAG.TDI]
PB0: U1.26(PB0) ; port PB0  [project net GPIO1]
PB1: U1.27(PB1) ; port SPI1.DRDY
PB2: U1.28(PB2-BOOT1(PB2)) ; port PB2  [project net BIND]
PB3: U1.55(PB3(JTDO/TRACESWO)) ; port JTAG.TDO  [project net JTAG.TDO]
PB4: U1.56(PB4(NJTRST)) ; port LEDs.LED2  [project net LEDs.LED2]
PB5: U1.57(PB5) ; port PB5  [project net MPU_INT]
PB6: U1.58(PB6) ; port Servos.Servo7, port I2C1.SCL  [project net I2C1.SCL]
PB7: U1.59(PB7) ; port Servos.Servo8, port I2C1.SDA  [project net I2C1.SDA]
PB8: U1.61(PB8) ; port CAN.RX  [project net CAN.RX]
PB9: U1.62(PB9) ; port CAN.TX  [project net CAN.TX]
PB10: U1.29(PB10) ; port I2C2.SCL  [project net I2C2.SCL]
PB11: U1.30(PB11) ; port I2C2.SDA  [project net I2C2.SDA]
PB12: U1.33(PB12) ; port SPI2.CS_MPU  [project net CS_MPU]
PB13: U1.34(PB13) ; port SPI2.SCLK
PB14: U1.35(PB14) ; port SPI2.MISO  [project net MISO]
PB15: U1.36(PB15) ; port SPI2.MOSI  [project net MOSI]
PC0: U1.8(PC0) ; port PC0  [project net ADC_2]
PC1: U1.9(PC1) ; port PC1  [project net ADC_3]
PC2: U1.10(PC2) ; port LEDs.LED3  [project net LEDs.LED3]
PC3: U1.11(PC3) ; port PC3  [project net ADC_1]
PC4: U1.24(PC4) ; port PC4
PC5: U1.25(PC5) ; port LEDs.LED4  [project net LEDs.LED4]
PC6: U1.37(PC6) ; port Servos.Servo1, harness UART6.TX
PC7: U1.38(PC7) ; port Servos.Servo2, harness UART6.RX
PC8: U1.39(PC8) ; port Servos.Servo3
PC9: U1.40(PC9) ; port Servos.Servo4
PC10: U1.51(PC10) ; harness UART3.TX
PC11: U1.52(PC11) ; harness UART3.RX
PC12: U1.53(PC12) ; harness UART5.TX
PC13: U1.2(PC13) ; port SPI2.CS_BARO  [project net CS_BARO]
PC14: U1.3(PC14-OSC32_IN(PC14)) ; port PC14  [project net MAG_INT]
PC15: U1.4(PC15-OSC32_OUT(PC15)) ; port LEDs.LED5  [project net LEDs.LED5]
PD2: U1.54(PD2) ; harness UART5.RX
PH0-OSC_IN: C1.2 U1.5(PH0-OSC_IN(PH0)) Y1.1(OSC1)
PH0-OSC_OUT: C2.2 U1.6(PH1-OSC_OUT(PH1)) Y1.2(OSC2)
VDDA: C11.2 C12.1 L1.2 U1.13(VDDA)
NetC3_2: C3.2 U1.47(VCAP_2)
NetC4_2: C4.2 U1.31(VCAP_1)

### Notes on the sheet
- SERVO_6
- SERVO_5
- SPI1_DRDY
- PB0
- UART2_TX
- UART2_RX
- SPI1_CS
- SPI1_MISO
- SPI1_SCLK
- JTAG_TDO
- MPU_INT
- LED2
- BIND_BUTTON
- SERVO_7/I2C1_SCL
- LED1
- UART1_RX
- UART1_TX/USB_VBUS
- SPI1_MOSI
- CAN_RX
- CAN_TX
- SERVO_8/I2C1_SDA
- I2C2_SCL
- JTAG_TDI
- JTAG_TCK
- JTAG_TMS
- PA11/USB_DN
- PA12/USB_DP
- SPI2_MOSI
- SPI2_MISO
- SPI2_SCLK
- SPI2_CS_MPU
- I2C2_SDA
- LED3
- ADC_1
- ADC_3
- ADC_2
- UART5_RX
- LED4
- SERVO_2
- SERVO_1
- VBAT_MEAS
- UART3_TX
- UART3_RX
- PC12/UART5_TX
- SERVO_4
- SERVO_3
- SPI2_CS_BARO
- MAG_INT
- LED5
- JTAG_RST
- Sheet Title:
- ProjectTitle:
- Size:
- Date:
- A
- Number:
- Rev:
- Sheet         of
- Drawn by:

### Library data of the parts
C1 C2 = CAP: Capacitor; Manufacturer Part Number: CC0402JRNPO9BN100; Manufacturer: Yageo; Supplier 1: Digi-Key; Supplier Part Number 1: 311-1014-1-ND; ComponentLink1URL: http://www.yageo.com/documents/recent/UPY-GP_NP0_16V-to-50V_10.pdf; ComponentLink1Description: Datasheet
C3-C5 = CAP: Capacitor; Manufacturer: Yageo; Manufacturer Part Number: CC0402MRX5R5BB225; Supplier 1: Digi-Key; Supplier Part Number 1: 311-1442-1-ND; ComponentLink1URL: http://www.yageo.com/documents/recent/UPY-GPHC_X5R_4V-to-50V_19.pdf; ComponentLink1Description: Datasheet
C6 = CAP: Capacitor; Manufacturer: Yageo; Manufacturer Part Number: CC0603KRX5R6BB475; Supplier 1: Digi-Key; Supplier Part Number 1: 311-1455-1-ND; ComponentLink1URL: http://www.yageo.com/documents/recent/UPY-GPHC_X5R_4V-to-50V_19.pdf; ComponentLink1Description: Datasheet
C7-C10 C12 = Cap: as C52 on sheet Data Logger; Supplier 1: Digi-Key; Supplier Part Number 1: 311-1345-1-ND; ComponentLink1Description: Datasheet; ComponentLink1URL: http://www.yageo.com/documents/recent/UPY-GPHC_X7R_6.3V-to-50V-v12.pdf
C11 = CAP: Capacitor; Manufacturer Part Number: CC0402KRX5R5BB105; Manufacturer: Yageo; Supplier 1: Digi-Key; Supplier Part Number 1: 311-1438-1-ND; ComponentLink1URL: http://www.yageo.com/documents/recent/UPY-GPHC_X5R_4V-to-50V_19.pdf; ComponentLink1Description: Datasheet
L1 = Bead Ferrite: Manufacturer: Murata Electronics North America; Impedance @ Frequency: 1 kOhm @ 100MHz; DC Resistance (DCR): 490 mOhm Max; Current Rating: 350mA; Supplier 1: Digi-Key; Supplier Part Number 1: 490-5442-1-ND; Manufacturer Part Number: BLM15AX102SN1D; ComponentLink1URL: http://search.murata.co.jp/Ceramy/image/img/PDF/ENG/L0110S0100BLM15AX_SN.pdf; ComponentLink1Description: Datasheet
R11 R12 = RES: as R45 on sheet Data Logger; Supplier 1: Digi-Key; Supplier Part Number 1: 311-10.0KLRCT-ND; ComponentLink1URL: http://www.yageo.com/NewPortal/yageodocoutput?fileName=/pdf/R-Chip/PYu-RC_Group_51_RoHS_L_3.pdf; ComponentLink1Description: Datasheet
U1 = STM32F405RGT6: ARM Cortex-M4 32-bit MCU+FPU, 210 DMIPS, 1024 kB Flash, 192 kB Internal RAM, 51 I/Os, 64-pin LQFP, -40 to 85 degC, Tray; Manufacturer: STMicroelectronics; D/A Converter: 2x12-bit; FLASH Size (Prog) (kB): 1024; I/Os (High Current): 51; Internal RAM Size (kB): 192; Operating Frequency(F) (Processor speed) (MHz): 168; Supply Voltage(Vcc) max (V): 3.6; Supply Voltage(Vcc) min (V): 1.8; DatasheetVersion: Rev. 4; PackageVersion: Rev. 4, 06/2013; PackageReference: LQFP64; PackageDescription: 64-Pin Low Profile Quad Flat Package, 10 x 10 mm Body, 0.5 mm Pitch; Supplier 1: Digi-Key; Supplier Part Number 1: 497-11767-ND; Supplier 2: Farnell; Supplier Part Number 2: 2064363; Supplier 3: Newark; Supplier Part Number 3: 73T2329; Supplier 4: Mouser; Supplier Part Number 4: 511-STM32F405RGT6; Core: ARM Cortex-M4; Packing: Tray; Mounting Technology: Surface Mount; PartNumber: STM32F405RGT6; ComponentLink2Description: Manufacturer URL; ComponentLink2URL: http://www.st.com/web/en/home.html; ComponentLink1Description: Datasheet; ComponentLink1URL: http://www.st.com/st-web-ui/static/active/en/resource/technical/document/datasheet/DM00037051.pdf; ComponentLink3Description: Package Specification; ComponentLink3URL: http://www.st.com/st-web-ui/static/active/en/resource/technical/document/datasheet/DM00037051.pdf; Manufacturer Part Number: STM32F405RGT6
Y1 = XTAL_1: Crystal Oscillator with ground points; pin to pad: 2>3 3>2; Manufacturer: Abracon LLC; Manufacturer Part Number: ABM8G-12.000MHZ-4Y-T3; Frequency Stability: ±30ppm; ESR (Equivalent Series Resistance): 120 Ohm; Frequency: 12MHz; Load Capacitance: 10pF; Supplier 1: Digi-Key; Supplier Part Number 1: 535-10901-1-ND; Frequency Tolerance: ±30ppm; ComponentLink1URL: http://www.abracon.com/Resonators/ABM8G.pdf; ComponentLink1Description: Datasheet

## Sheet CAN, JTAG, LDO, USB.SchDoc
size A; DocumentNumber: 7; SheetNumber: 7; SheetTotal: 16
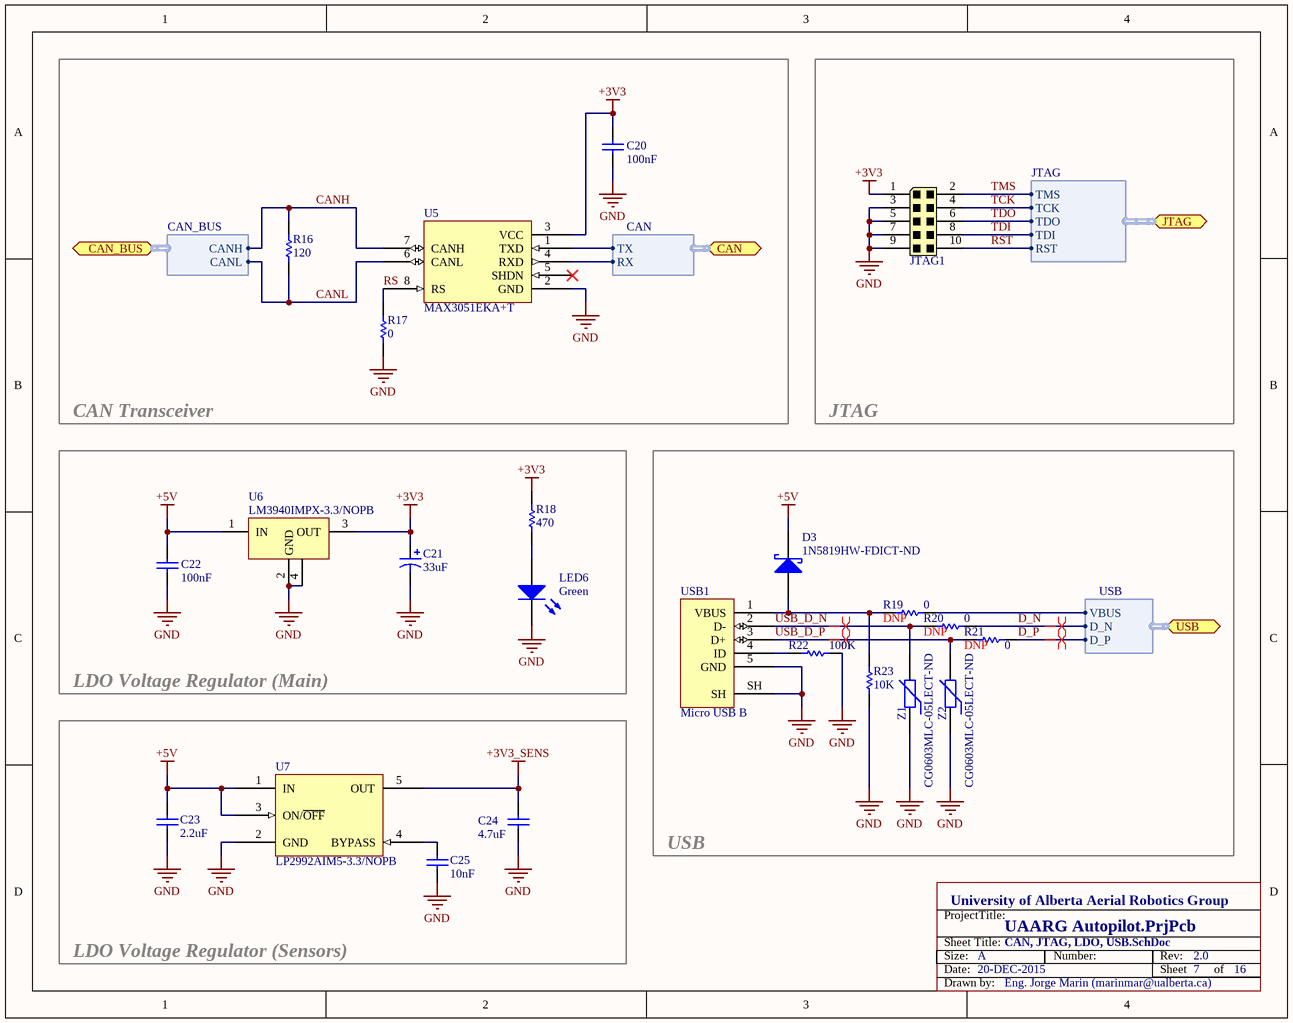
[diagram p7: CAN, JTAG, LDO, USB.SchDoc]

### Parts
C20  value 100nF  [CAP_0402[1005M]]  (hidden comment: Cap)
C21  value 33uF  [CAPMP3216X16N]  (hidden comment: CAP_POL)
C22  value 100nF  [CAP_0402[1005M]]  (hidden comment: Cap)
C23  value 2.2uF  [CAP_0402[1005M]]  (hidden comment: CAP)
C24  value 4.7uF  [CAP_0603[1608M]]  (hidden comment: CAP)
C25  value 10nF  [CAP_0402[1005M]]  (hidden comment: Cap)
D3  Supplier Part Number 1: 1N5819HW-FDICT-ND  [SOD-123]  (hidden comment: SCHOTTKY DIODE)
JTAG1  Mini JTAG 5x2 TH  [Header 5x2 1.27mm SMD]  (value not drawn)
LED6  Color: Green  [LED_0603[1608M]]  (hidden comment: LED)
R16  value 120  [RES_0402[1005M]]  (hidden comment: RES)
R17  value 0  [RES_0402[1005M]]  (hidden comment: RES)
R18  value 470  [RES_0402[1005M]]  (hidden comment: RES)
R19  value 0  Note: DNP  [RES_0402[1005M]]  (hidden comment: RES)
R20  value 0  Note: DNP  [RES_0402[1005M]]  (hidden comment: RES)
R21  value 0  Note: DNP  [RES_0402[1005M]]  (hidden comment: RES)
R22  value 100K  [RES_0402[1005M]]  (hidden comment: RES)
R23  value 10K  [RES_0402[1005M]]  (hidden comment: RES)
U5  Manufacturer Part Number: MAX3051EKA+T  [SOT23-8_N]  (hidden comment: MAX3051)
U6  LM3940IMPX-3.3/NOPB  [SOT223-3]
U7  Manufacturer Part Number: LP2992AIM5-3.3/NOPB  [SOT23-5_N]  (hidden comment: LP2992)
USB1  Micro USB B  [Micro USB B_SMT]
Z1  Supplier Part Number 1: CG0603MLC-05LECT-ND  [GEN2_0603[1608M]]  (hidden comment: CG0603MLC-05LE)
Z2  Supplier Part Number 1: CG0603MLC-05LECT-ND  [GEN2_0603[1608M]]  (hidden comment: CG0603MLC-05LE)

### Blocks framed on the sheet
CAN Transceiver: C20 R16 R17 U5
JTAG: JTAG1
LDO Voltage Regulator (Main): C21 C22 LED6 R18 U6
USB: D3 R19-R23 USB1 Z1 Z2
LDO Voltage Regulator (Sensors): C23-C25 U7

### Ports
CAN (harness CAN), CAN_BUS (harness CAN_BUS), JTAG (harness JTAG), USB (harness USB)

### Harnesses
JTAG: TMS, TCK, TDO, TDI, RST
CAN: TX, RX
CAN_BUS: CANH, CANL
USB: VBUS, D_N, D_P

### Nets
+3V3: C20.1 C21.1 JTAG1.1 R18.1 U5.3(VCC) U6.3(OUT)
+3V3_SENS: C24.2 U7.5(OUT)
+5V: C22.1 C23.2 D3.2(K) U6.1(IN) U7.1(IN) U7.3(ON/~{OFF})
GND: C20.2 C21.2 C22.2 C23.1 C24.1 C25.2 JTAG1.3 JTAG1.5 JTAG1.7 JTAG1.9 LED6.2(K) R17.1 R22.1 R23.1 U5.2(GND) U6.2(GND) U6.4(TAB) U7.2(GND) USB1.5(GND) USB1.SH Z1.1 Z2.1
CAN.RX: U5.4(RXD) ; port CAN.RX
CAN.TX: U5.1(TXD) ; port CAN.TX
CANH: R16.2 U5.7(CANH) ; port CAN_BUS.CANH  [project net CAN_BUS.CANH]
CANL: R16.1 U5.6(CANL) ; port CAN_BUS.CANL  [project net CAN_BUS.CANL]
D_N: R20.1 ; port USB.D_N
D_P: R21.1 ; port USB.D_P
PA9: R19.2 ; port USB.VBUS
RS: R17.2 U5.8(RS)
RST: JTAG1.10 ; port JTAG.RST  [project net JTAG.RST]
TCK: JTAG1.4 ; port JTAG.TCK  [project net JTAG.TCK]
TDI: JTAG1.8 ; port JTAG.TDI  [project net JTAG.TDI]
TDO: JTAG1.6 ; port JTAG.TDO  [project net JTAG.TDO]
TMS: JTAG1.2 ; port JTAG.TMS  [project net JTAG.TMS]
USB_D_N: R20.2 USB1.2(D-) Z1.2
USB_D_P: R21.2 USB1.3(D+) Z2.2
NetC25_1: C25.1 U7.4(BYPASS)
NetD3_1: D3.1(A) R19.1 R23.2 USB1.1(VBUS)
NetLED6_1: LED6.1(A) R18.2
NetR22_2: R22.2 USB1.4(ID)

Not connected (* = marked no-connect by the designer): U5 5(SHDN)*

### Layout directives
differential pair: D_N, D_P, USB_D_N, USB_D_P

### Notes on the sheet
- Sheet Title:
- ProjectTitle:
- Size:
- Date:
- A
- Number:
- Rev:
- Sheet         of
- Drawn by:

### Library data of the parts
C20 C22 = Cap: Capacitor; Manufacturer: Yageo; Manufacturer Part Number: CC0402KRX7R6BB104; Supplier 1: Digi-Key; Supplier Part Number 1: 311-1345-1-ND; ComponentLink1URL: http://www.yageo.com/documents/recent/UPY-GPHC_X7R_6.3V-to-50V-v12.pdf; ComponentLink1Description: Datasheet
C21 = CAP_POL: Polarized Capacitor; Manufacturer: Kemet; Manufacturer Part Number: T491A336K010AT; Supplier 1: Digi-Key; Supplier Part Number 1: 399-5279-1-ND; ComponentLink1Description: Datasheet; ComponentLink1URL: http://www.kemet.com/Lists/ProductCatalog/Attachments/254/KEM_T2005_T491.pdf
C23 = CAP: as C3 on sheet MCU; Supplier 1: Digi-Key; Supplier Part Number 1: 311-1442-1-ND; ComponentLink1URL: http://www.yageo.com/documents/recent/UPY-GPHC_X5R_4V-to-50V_19.pdf; ComponentLink1Description: Datasheet
C24 = CAP: as C6 on sheet MCU; Supplier 1: Digi-Key; Supplier Part Number 1: 311-1455-1-ND; ComponentLink1URL: http://www.yageo.com/documents/recent/UPY-GPHC_X5R_4V-to-50V_19.pdf; ComponentLink1Description: Datasheet
C25 = Cap: Capacitor; Manufacturer: Yageo; Manufacturer Part Number: CC0402KRX7R7BB103; ComponentLink1URL: http://www.yageo.com/documents/recent/UPY-GPHC_X7R_6.3V-to-50V-v12.pdf; ComponentLink1Description: Datasheet; Supplier 1: Digi-Key; Supplier Part Number 1: 311-1042-1-ND
D3 = SCHOTTKY DIODE: Typical SchottkyDiode; Manufacturer: Diodes Incorporated; Manufacturer Part Number: 1N5819HW-7-F; Capacitance @ Vr, F: 60pF @ 4V, 1MHz; Current - Reverse Leakage @ Vr: 1mA @ 40V; Speed: Fast Recovery =< 500ns, > 200mA (Io); Voltage - Forward (Vf) (Max) @ If: 450mV @ 1A; Voltage - DC Reverse (Vr) (Max): 40V; Current - Average Rectified (Io): 1A; Supplier 1: Digi-Key; Diode Type: Schottky; ComponentLink1URL: http://www.diodes.com/_files/datasheets/ds30217.pdf; ComponentLink1Description: Datasheet
JTAG1 = Mini JTAG 5x2 TH: Mini JTAG connector header 10 pos 5x2 pitch 1.27mm TH; Manufacturer: Samtec Inc.; Manufacturer Part Number: FTSH-105-01-F-DV-K; Supplier 1: Digi-Key; Supplier Part Number 1: SAM8796-ND; ComponentLink1URL: http://suddendocs.samtec.com/prints/ftsh-1xx-xx-xxx-dv-xxx-mkt.pdf; ComponentLink1Description: Datasheet
LED6 = LED: as LED8 on sheet Data Logger; Supplier 1: Digi-Key; Supplier Part Number 1: 160-1435-1-ND; ComponentLink1URL: http://optoelectronics.liteon.com/upload/download/DS22-2000-074/S_110_LTST-C190KGKT.pdf; ComponentLink1Description: Datasheet
R16 = RES: Resistor; Manufacturer: Yageo; Manufacturer Part Number: RC0402FR-07120RL; Supplier 1: Digi-Key; Supplier Part Number 1: 311-120LRCT-ND; ComponentLink1URL: http://www.yageo.com/NewPortal/yageodocoutput?fileName=/pdf/R-Chip/PYu-RC_Group_51_RoHS_L_3.pdf; ComponentLink1Description: Datasheet
R17 R19-R21 = RES: as R1 on sheet UAARG Autopilot; Supplier 1: Digi-Key; Supplier Part Number 1: 311-0.0JRCT-ND; ComponentLink1URL: http://www.yageo.com/NewPortal/yageodocoutput?fileName=/pdf/R-Chip/PYu-RC_Group_51_RoHS_L_3.pdf; ComponentLink1Description: Datasheet
R18 = RES: Resistor; Manufacturer Part Number: RC0402JR-07470RL; Manufacturer: Yageo; Supplier 1: Digi-Key; Supplier Part Number 1: 311-470JRCT-ND; ComponentLink1URL: http://www.yageo.com/NewPortal/yageodocoutput?fileName=/pdf/R-Chip/PYu-RC_Group_51_RoHS_L_3.pdf; ComponentLink1Description: Datasheet
R22 = RES: Resistor; Manufacturer: Yageo; Manufacturer Part Number: RC0402FR-07100KL; Supplier 1: Digi-Key; Supplier Part Number 1: 311-100KLRCT-ND; ComponentLink1URL: http://www.yageo.com/NewPortal/yageodocoutput?fileName=/pdf/R-Chip/PYu-RC_Group_51_RoHS_L_3.pdf; ComponentLink1Description: Datasheet
R23 = RES: as R45 on sheet Data Logger; Supplier 1: Digi-Key; Supplier Part Number 1: 311-10.0KLRCT-ND; ComponentLink1URL: http://www.yageo.com/NewPortal/yageodocoutput?fileName=/pdf/R-Chip/PYu-RC_Group_51_RoHS_L_3.pdf; ComponentLink1Description: Datasheet
U5 = MAX3051: MAX3051 CAN Transceiver; Manufacturer: Maxim Integrated; Supplier 1: Digi-Key; Supplier Part Number 1: MAX3051EKA+TCT-ND; ComponentLink1URL: http://datasheets.maximintegrated.com/en/ds/MAX3051.pdf; ComponentLink1Description: Datasheet
U6 = LM3940IMPX-3.3/NOPB: IC REG LDO 3.3V 1A SOT223; Manufacturer: Texas Instruments; Supplier 1: Digi-Key; Supplier Part Number 1: LM3940IMPX-3.3/NOPBCT-ND; Manufacturer Part Number: LM3940IMPX-3.3/NOPB; ComponentLink1URL: http://www.ti.com/lit/ds/symlink/lm3940.pdf; ComponentLink1Description: Datasheet
U7 = LP2992: LP2992 LDO Voltage Regulator; Manufacturer: Texas Instruments; Voltage - Output: 3.3V; Current - Output: 250mA; Voltage - Dropout (Typical): 0.45V @ 250mA; Voltage - Input: Up to 16V; Supplier 1: Digi-Key; Supplier Part Number 1: LP2992AIM5-3.3/NOPBCT-ND; ComponentLink1URL: http://www.ti.com/lit/ds/symlink/lp2992.pdf; ComponentLink1Description: Datasheet
USB1 = Micro USB B: Micro USB Connector Type B; Manufacturer Part Number: 0473460001; Manufacturer: Molex, LLC; Supplier 1: Digi-Key; Supplier Part Number 1: WM17141CT-ND; ComponentLink1URL: http://www.molex.com/pdm_docs/sd/473460001_sd.pdf; ComponentLink1Description: Datasheet
Z1 Z2 = Res Varistor: VARISTOR 0603; Manufacturer: Bourns Inc.; Maximum DC Volts: 5VDC; Supplier 1: Digi-Key; Manufacturer Part Number: CG0603MLC-05LE; ComponentLink1URL: http://www.bourns.com/docs/Product-Datasheets/MLC.pdf; ComponentLink1Description: Datasheet

## Sheet Telemetry, I2C.SchDoc
size A; DocumentNumber: 8; SheetNumber: 8; SheetTotal: 16
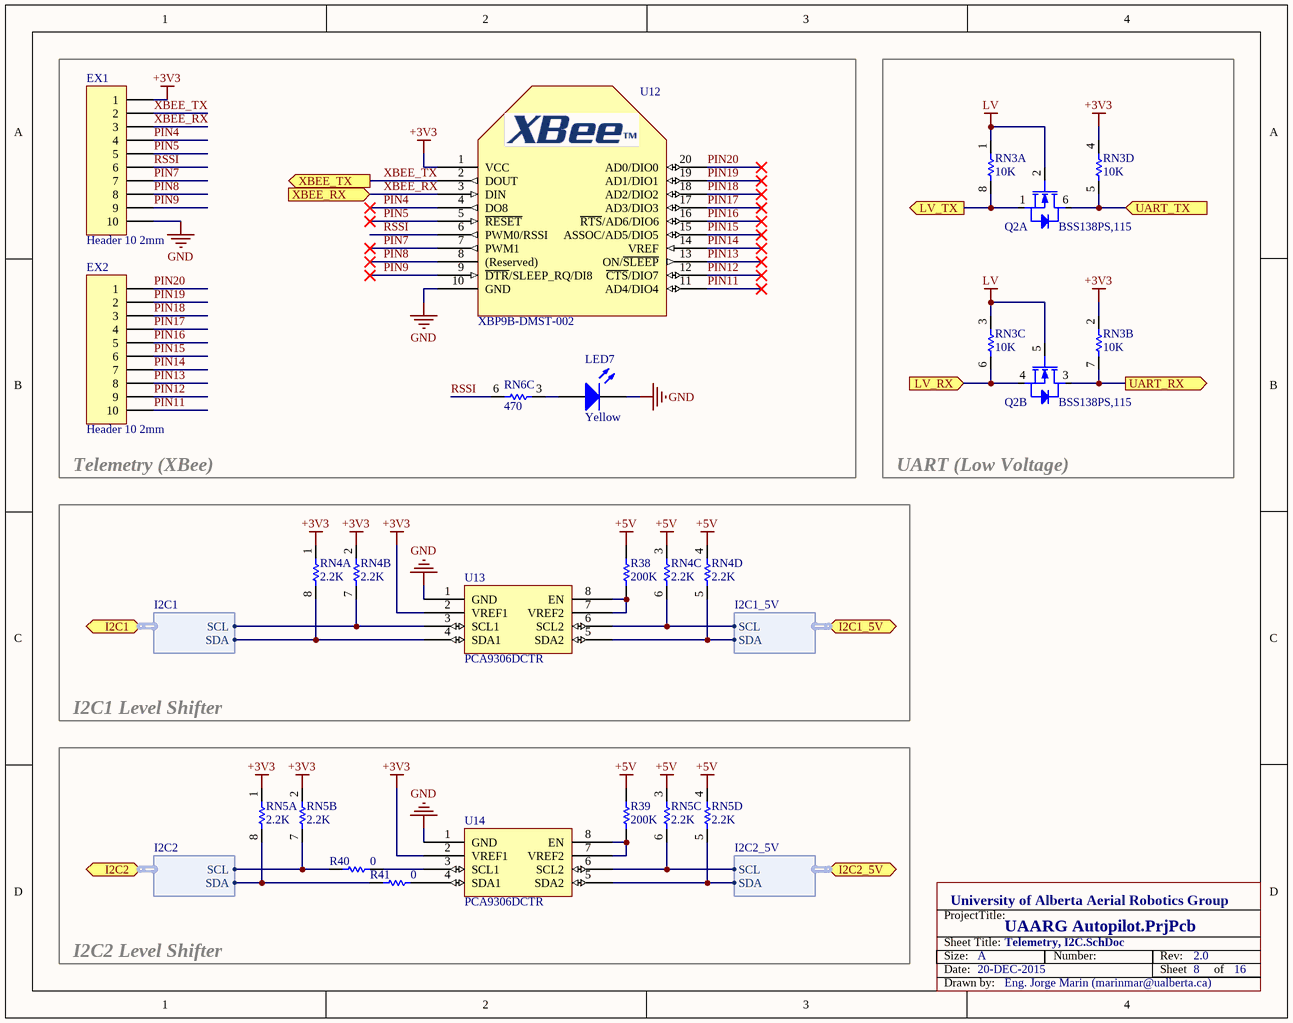
[diagram p8: Telemetry, I2C.SchDoc]

### Parts
EX1  Header 10 2mm  [2mm pitch female header]
EX2  Header 10 2mm  [2mm pitch female header]
LED7  Color: Yellow  [LED_0603[1608M]]  (hidden comment: LED)
Q2  Manufacturer Part Number: BSS138PS,115  [SOT363-6]  (hidden comment: N-CH MOSFET-D-ARRAY)  (parts A,B of 2)
R38  value 200K  [RES_0402[1005M]]  (hidden comment: RES)
R39  value 200K  [RES_0402[1005M]]  (hidden comment: RES)
R40  value 0  [JUMPER_RES_0402]  (hidden comment: RES)
R41  value 0  [JUMPER_RES_0402]  (hidden comment: RES)
RN3  value 10K  [RES ARRAY SMD]  (hidden comment: Res Network 1)  (parts A,B,C,D of 4)
RN4  value 2.2K  [RES ARRAY SMD]  (hidden comment: Res Network 1)  (parts A,B,C,D of 4)
RN5  value 2.2K  [RES ARRAY SMD]  (hidden comment: Res Network 1)  (parts A,B,C,D of 4)
RN6  value 470  [RES ARRAY SMD]  (hidden comment: Res Network 1)  (part C of 4)
U12  Manufacturer Part Number: XBP9B-DMST-002  [XBee PRO for headers]  (hidden comment: XBee / XBee PRO)
U13  Manufacturer Part Number: PCA9306DCTR  [DCT-8 (LSSOP-8)]  (hidden comment: PCA9306DC)
U14  Manufacturer Part Number: PCA9306DCTR  [DCT-8 (LSSOP-8)]  (hidden comment: PCA9306DC)

### Blocks framed on the sheet
Telemetry (XBee): EX1 EX2 LED7 RN6 U12
UART (Low Voltage): Q2 RN3
I2C1 Level Shifter: R38 RN4 U13
I2C2 Level Shifter: R39-R41 RN5 U14

### Ports
I2C1 (harness I2C1), I2C1_5V (harness I2C1_5V), I2C2 (harness I2C2), I2C2_5V (harness I2C2_5V), LV_RX (in), LV_TX (out), UART_RX (out), UART_TX (in), XBEE_RX (in), XBEE_TX (out)

### Harnesses
I2C1: SDA, SCL
I2C2: SDA, SCL
I2C1_5V: SDA, SCL
I2C2_5V: SDA, SCL

### Nets
+3V3: EX1.1 RN3.2 RN3.4 RN4.1 RN4.2 RN5.1 RN5.2 U12.1(VCC) U13.2(VREF1) U14.2(VREF1)
+5V: R38.1 R39.1 RN4.3 RN4.4 RN5.3 RN5.4
GND: EX1.10 LED7.2(K) U12.10(GND) U13.1(GND) U14.1(GND)
LV: Q2.2(G1) Q2.5(G2) RN3.1 RN3.3
I2C1.SCL: RN4.7 U13.3(SCL1) ; port I2C1.SCL
I2C1.SDA: RN4.8 U13.4(SDA1) ; port I2C1.SDA
I2C1_5V.SCL: RN4.6 U13.6(SCL2) ; port I2C1_5V.SCL
I2C1_5V.SDA: RN4.5 U13.5(SDA2) ; port I2C1_5V.SDA
I2C2.SCL: R40.2 RN5.7 ; port I2C2.SCL
I2C2.SDA: R41.2 RN5.8 ; port I2C2.SDA
I2C2_5V.SCL: RN5.6 U14.6(SCL2) ; port I2C2_5V.SCL
I2C2_5V.SDA: RN5.5 U14.5(SDA2) ; port I2C2_5V.SDA
LV_RX: Q2.4(S2) RN3.6 ; port LV_RX
LV_TX: Q2.1(S1) RN3.8 ; port LV_TX
PIN4: EX1.4 U12.4(DO8)
PIN5: EX1.5 U12.5(~{RESET})
PIN7: EX1.7 U12.7(PWM1)
PIN8: EX1.8 U12.8((Reserved))
PIN9: EX1.9 U12.9(~{DTR}/SLEEP_RQ/DI8)
PIN11: EX2.10 U12.11(AD4/DIO4)
PIN12: EX2.9 U12.12(~{CTS}/DIO7)
PIN13: EX2.8 U12.13(ON/~{SLEEP})
PIN14: EX2.7 U12.14(VREF)
PIN15: EX2.6 U12.15(ASSOC/AD5/DIO5)
PIN16: EX2.5 U12.16(~{RTS}/AD6/DIO6)
PIN17: EX2.4 U12.17(AD3/DIO3)
PIN18: EX2.3 U12.18(AD2/DIO2)
PIN19: EX2.2 U12.19(AD1/DIO1)
PIN20: EX2.1 U12.20(AD0/DIO0)
RSSI: EX1.6 RN6.6 U12.6(PWM0/RSSI)
UART_RX: Q2.3(D1) RN3.7 ; port UART_RX
UART_TX: Q2.6(D1) RN3.5 ; port UART_TX
XBEE_RX: EX1.3 U12.3(DIN) ; port XBEE_RX  [project net UART.UART2.TX]
XBEE_TX: EX1.2 U12.2(DOUT) ; port XBEE_TX  [project net UART.UART2.RX]
NetLED7_1: LED7.1(A) RN6.3
NetR38_2: R38.2 U13.7(VREF2) U13.8(EN)
NetR39_2: R39.2 U14.7(VREF2) U14.8(EN)
NetR40_1: R40.1 U14.3(SCL1)
NetR41_1: R41.1 U14.4(SDA1)

### Notes on the sheet
- Sheet Title:
- ProjectTitle:
- Size:
- Date:
- A
- Number:
- Rev:
- Sheet         of
- Drawn by:

### Library data of the parts
EX1 EX2 = Header 10: Header, 10-Pin; Manufacturer: Sullins Connector Solutions; Manufacturer Part Number: NPPN101BFCN-RC; ComponentLink1Description: Datasheet; ComponentLink1URL: http://www.sullinscorp.com/drawings/75_1BFC_10483.pdf; Supplier 1: Digi-Key; Supplier Part Number 1: S5751-10-ND
LED7 = LED: as LED4 on sheet Switches, UI; Supplier 1: Digi-Key; Supplier Part Number 1: 160-1184-1-ND; ComponentLink1URL: http://media.digikey.com/pdf/Data%20Sheets/Lite-On%20PDFs/LTST-C190YKT.pdf; ComponentLink1Description: Datasheet
Q2 = N-CH MOSFET-D-ARRAY: N-CH MOSFET W/ DIODE DUAL PACKAGE; Manufacturer: NXP Semiconductors; Vgs(th) (Max) @ Id: 1.5V @ 250µA; Current - Continuous Drain (Id) @ 25°C: 320mA; Power - Max: 420mW; Input Capacitance (Ciss) @ Vds: 50pF @ 10V; Gate Charge (Qg) @ Vgs: 0.8nC @ 4.5V; Rds On (Max) @ Id, Vgs: 1.6 Ohm @ 300mA, 10V; Drain to Source Voltage (Vdss): 60V; Supplier 1: Digi-Key; Supplier Part Number 1: 568-8393-1-ND; ComponentLink1URL: http://www.nxp.com/documents/data_sheet/BSS138PS.pdf; ComponentLink1Description: Datasheet
R38 R39 = RES: Resistor; Manufacturer: Yageo; Manufacturer Part Number: RC0402FR-07200KL; ComponentLink1URL: http://www.yageo.com/NewPortal/yageodocoutput?fileName=/pdf/R-Chip/PYu-RC_Group_51_RoHS_L_3.pdf; ComponentLink1Description: Datasheet; Supplier 1: Digi-Key; Supplier Part Number 1: 311-200KLRCT-ND
R40 R41 = RES: as R1 on sheet UAARG Autopilot; Supplier 1: Digi-Key; Supplier Part Number 1: 311-0.0JRCT-ND; ComponentLink1URL: http://www.yageo.com/NewPortal/yageodocoutput?fileName=/pdf/R-Chip/PYu-RC_Group_51_RoHS_L_3.pdf; ComponentLink1Description: Datasheet
RN3 = Res Network 1: Isolated Resistor Network; Manufacturer Part Number: YC164-JR-0710KL; Manufacturer: Yageo; Supplier 1: Digi-Key; Supplier Part Number 1: YC164J-10KCT-ND; ComponentLink1URL: http://www.yageo.com/NewPortal/yageodocoutput?fileName=/pdf/R-Chip/PYu-YC_TC_group_51_RoHS_L_0.pdf; ComponentLink1Description: Datasheet
RN4 RN5 = Res Network 1: Isolated Resistor Network; Manufacturer Part Number: YC164-JR-072K2L; Manufacturer: Yageo; Supplier 1: Digi-Key; Supplier Part Number 1: YC164J-2.2KCT-ND; ComponentLink1URL: http://www.yageo.com/NewPortal/yageodocoutput?fileName=/pdf/R-Chip/PYu-YC_TC_group_51_RoHS_L_0.pdf; ComponentLink1Description: Datasheet
RN6 = Res Network 1: as RN6 on sheet Data Logger; Supplier 1: Digi-Key; Supplier Part Number 1: YC164J-470CT-ND; ComponentLink1URL: http://www.yageo.com/NewPortal/yageodocoutput?fileName=/pdf/R-Chip/PYu-YC_TC_group_51_RoHS_L_0.pdf; ComponentLink1Description: Datasheet
U12 = XBee / XBee PRO: MODULE XBEE PRO S3B 900HP RPSMA; Manufacturer: Digi International; Current - Receiving: 29mA; Current - Transmitting: 215mA; Data Rate: 200Kbps; Modulation: FHSS; Frequency: 900MHz; Supplier 1: Digi-Key; Supplier Part Number 1: 602-1299-ND; ComponentLink1Description: Datasheet; ComponentLink1URL: https://www.google.ca/url?sa=t&rct=j&q=&esrc=s&source=web&cd=6&cad=rja&uact=8&ved=0CEYQFjAFahUKEwiKwrH8s-PIAhVNOIgKHaDJAYA&url=http%3A%2F%2Fwww.mouser.com%2Fpdfdocs%2FDigi_International_XbeePro_900HP_Datasheet.pdf&usg=AFQjCNEqRzBgr3l2kZ5UWvHUkIwjAYgYlQ
U13 U14 = PCA9306DC: IC VOLT-LEVEL TRANSLATOR SM8; Manufacturer: Texas Instruments; Supplier 1: Digi-Key; Supplier Part Number 1: 296-18509-1-ND; ComponentLink1URL: http://www.ti.com/lit/ds/symlink/pca9306.pdf; ComponentLink1Description: Datasheet